# Altium project PROC101D_SCH_With_Design_Updates..Notes_V1.0.PrjPcb (part 16 of 23)

## Sheet 32.SchDoc
size 513 x 386 mm
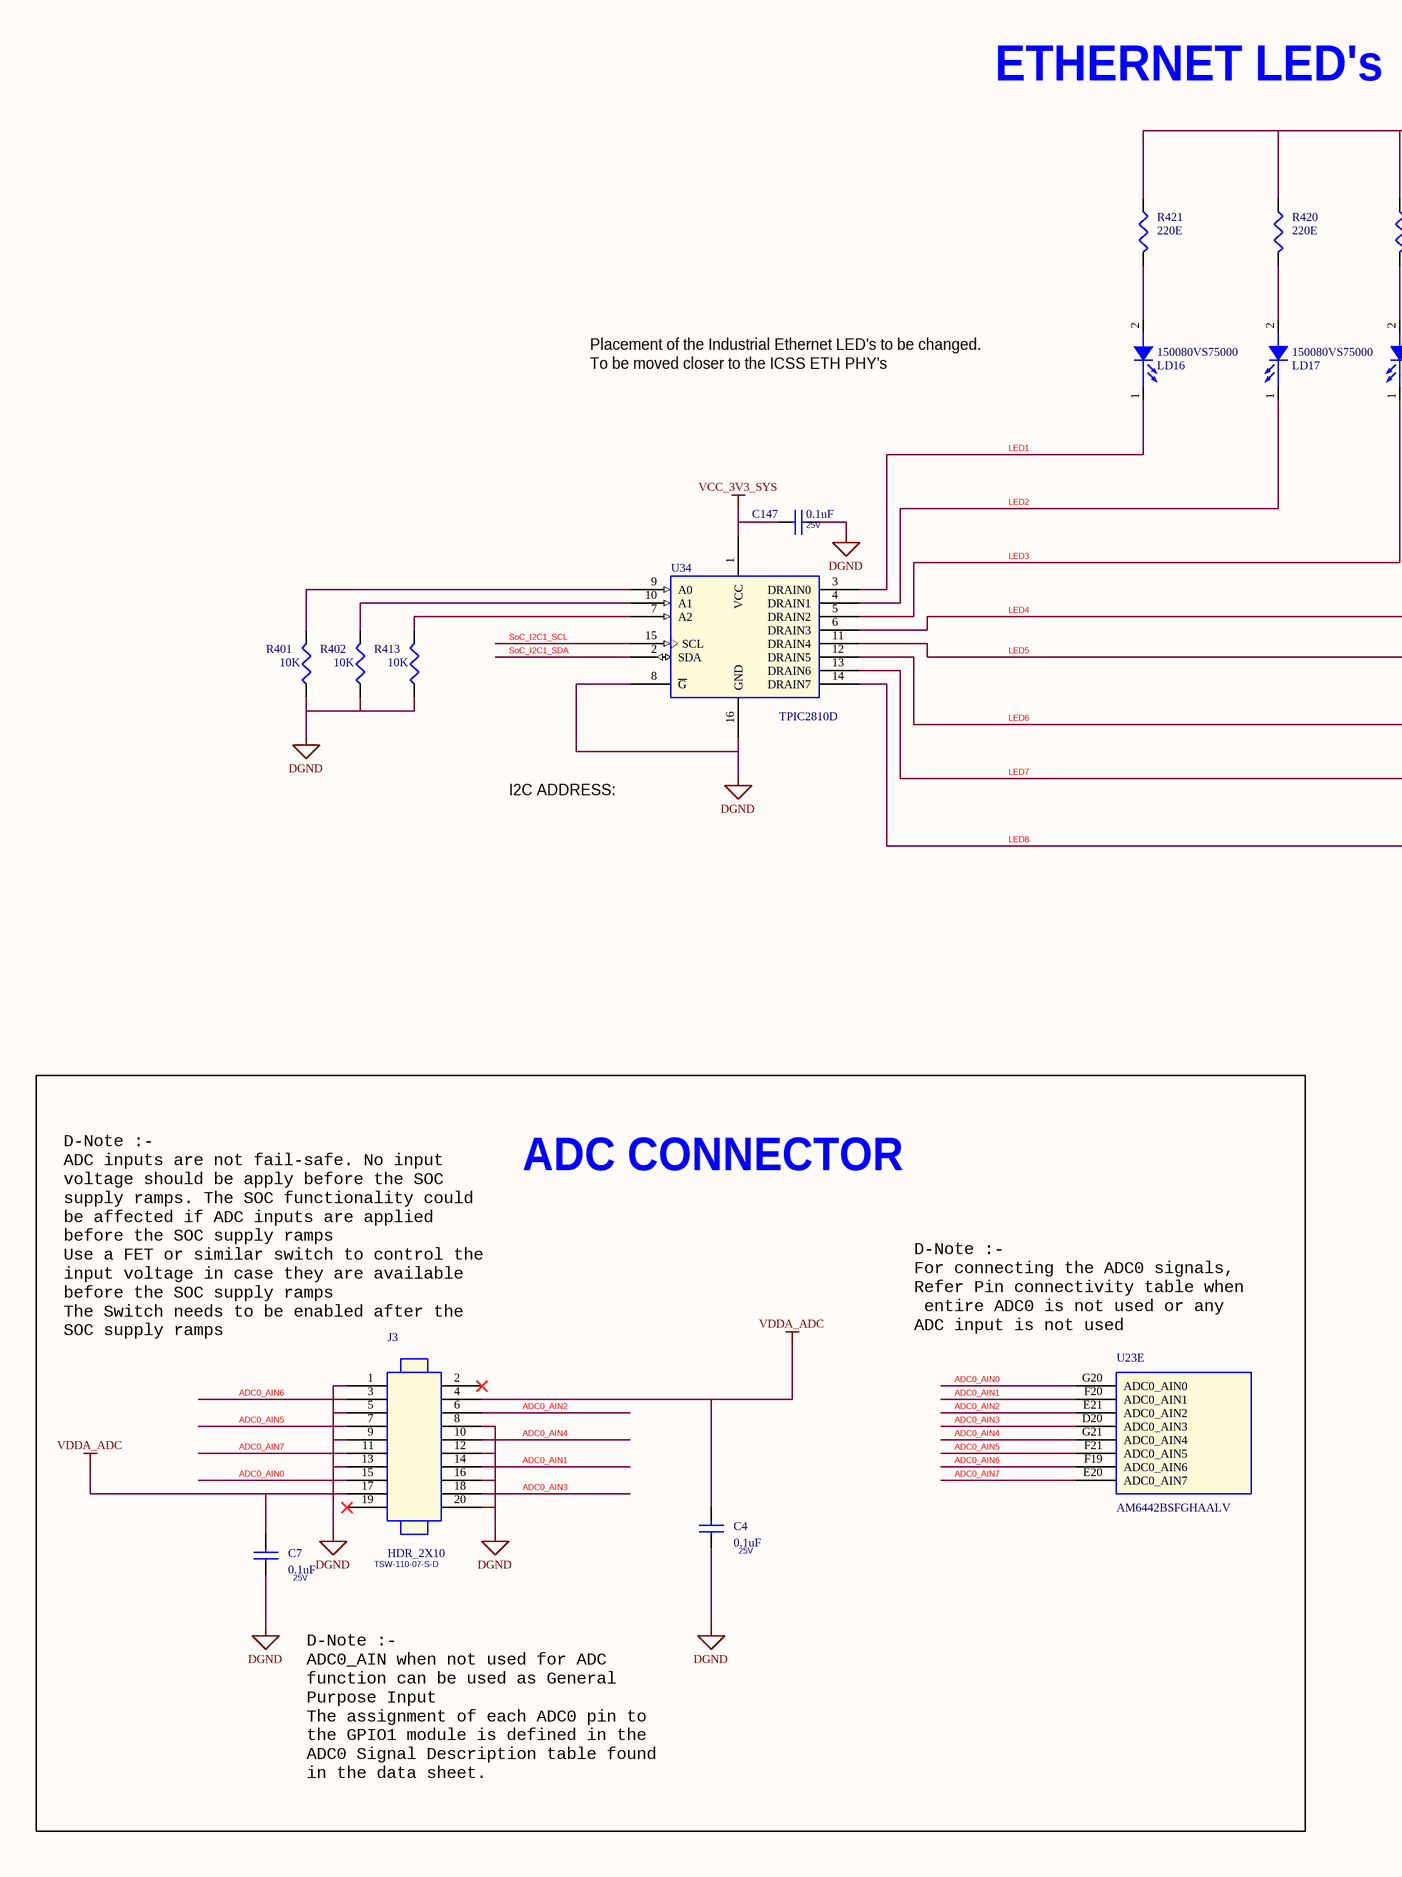
[diagram p58: 32.SchDoc, left]
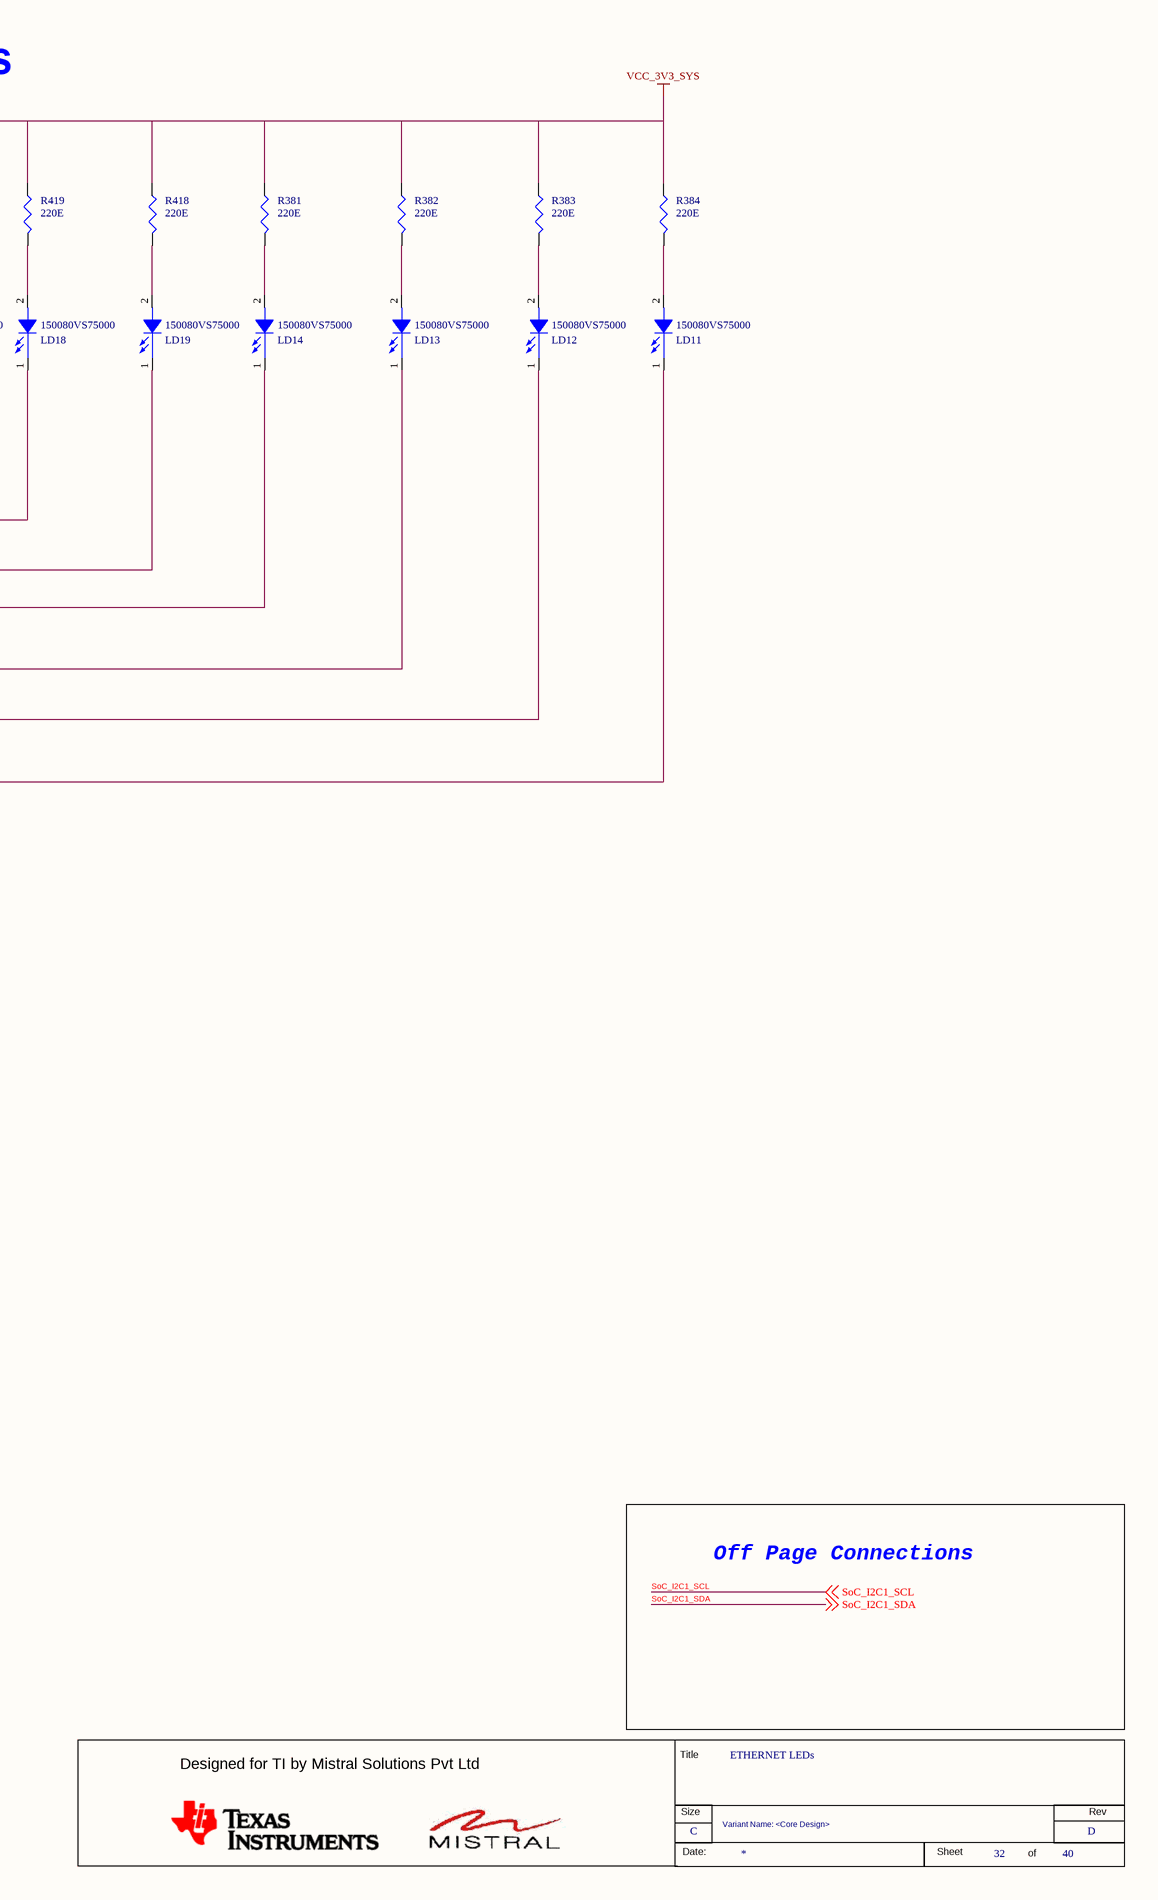
[diagram p59: 32.SchDoc, right]

### Parts
(Parts that share a designator on the sheet are numbered #1, #2 ... from top to bottom, then left to right.)
*#32  RevCode: D  Title: ETHERNET LEDs  Page Size: C  Page Number: 32  Page Count: 40  Variant Name: <Core Design>  (hidden comment: MISTRAL_TITLEBLK_CSIZE)  (graphical)
C4  0.1uF  Voltage: 25V  [CAP0402_0-75]
C7  0.1uF  Voltage: 25V  [CAP0402_0-75]
C147  0.1uF  Voltage: 25V  [CAP0402_0-75]
J3  HDR_2X10  Mfr_part_number: TSW-110-07-S-D  [HDR_2X10_TSW_100_S_T]
LD11  150080VS75000  [LED_150080VS75000_80X50_SMD_0-8]
LD12  150080VS75000  [LED_150080VS75000_80X50_SMD_0-8]
LD13  150080VS75000  [LED_150080VS75000_80X50_SMD_0-8]
LD14  150080VS75000  [LED_150080VS75000_80X50_SMD_0-8]
LD16  150080VS75000  [LED_150080VS75000_80X50_SMD_0-8]
LD17  150080VS75000  [LED_150080VS75000_80X50_SMD_0-8]
LD18  150080VS75000  [LED_150080VS75000_80X50_SMD_0-8]
LD19  150080VS75000  [LED_150080VS75000_80X50_SMD_0-8]
R381  220E  [RES0402_0-5]
R382  220E  [RES0402_0-5]
R383  220E  [RES0402_0-5]
R384  220E  [RES0402_0-5]
R401  10K  [RES0402_0-5]
R402  10K  [RES0402_0-5]
R413  10K  [RES0402_0-5]
R418  220E  [RES0402_0-5]
R419  220E  [RES0402_0-5]
R420  220E  [RES0402_0-5]
R421  220E  [RES0402_0-5]
U23  AM6442BSFGHAALV  [FCBGA441_31-49_680X680_2-6]  (part E of 16)
U34  TPIC2810D  [SOIC16_1-8]

### Blocks framed on the sheet
ADC CONNECTOR: C4 C7 J3 U23

### Nets
DGND: C4.1 C7.1 C147.2 J3.1 J3.5 J3.8 J3.9 J3.12 J3.13 J3.16 J3.20 R401.1 R402.1 R413.1 U34.8(~{G}) U34.16(GND)
VCC_3V3_SYS: C147.1 R381.1 R382.1 R383.1 R384.1 R418.1 R419.1 R420.1 R421.1 U34.1(VCC)
VDDA_ADC: C4.2 C7.2 J3.4 J3.17
ADC0_AIN0: J3.15 U23.G20(ADC0_AIN0)
ADC0_AIN1: J3.14 U23.F20(ADC0_AIN1)
ADC0_AIN2: J3.6 U23.E21(ADC0_AIN2)
ADC0_AIN3: J3.18 U23.D20(ADC0_AIN3)
ADC0_AIN4: J3.10 U23.G21(ADC0_AIN4)
ADC0_AIN5: J3.7 U23.F21(ADC0_AIN5)
ADC0_AIN6: J3.3 U23.F19(ADC0_AIN6)
ADC0_AIN7: J3.11 U23.E20(ADC0_AIN7)
LED1: LD16.1(CATHODE) U34.3(DRAIN0)
LED2: LD17.1(CATHODE) U34.4(DRAIN1)
LED3: LD18.1(CATHODE) U34.5(DRAIN2)
LED4: LD19.1(CATHODE) U34.6(DRAIN3)
LED5: LD14.1(CATHODE) U34.11(DRAIN4)
LED6: LD13.1(CATHODE) U34.12(DRAIN5)
LED7: LD12.1(CATHODE) U34.13(DRAIN6)
LED8: LD11.1(CATHODE) U34.14(DRAIN7)
SoC_I2C1_SCL: U34.15(SCL) ; off-sheet SoC_I2C1_SCL
SoC_I2C1_SDA: U34.2(SDA) ; off-sheet SoC_I2C1_SDA
NetLD11_2: LD11.2(ANODE) R384.2
NetLD12_2: LD12.2(ANODE) R383.2
NetLD13_2: LD13.2(ANODE) R382.2
NetLD14_2: LD14.2(ANODE) R381.2
NetLD16_2: LD16.2(ANODE) R421.2
NetLD17_2: LD17.2(ANODE) R420.2
NetLD18_2: LD18.2(ANODE) R419.2
NetLD19_2: LD19.2(ANODE) R418.2
NetR401_2: R401.2 U34.9(A0)
NetR402_2: R402.2 U34.10(A1)
NetR413_2: R413.2 U34.7(A2)

Not connected (* = marked no-connect by the designer): J3 2* 19*

### Notes on the sheet
- ETHERNET LED's
- Placement of the Industrial Ethernet LED's to be changed.
  To be moved closer to the ICSS ETH PHY's
- I2C ADDRESS: 0x60
- (near J3) D-Note :-
  ADC inputs are not fail-safe. No input
  voltage should be apply before the SOC
  supply ramps. The SOC functionality could
  be affected if ADC inputs are applied
  before the SOC supply ramps
  Use a FET or similar switch to control the
  input voltage in case they are available
  before the SOC supply ramps
  The Switch needs to be enabled after the
  SOC supply ramps
- D-Note :-
  For connecting the ADC0 signals,
  Refer Pin connectivity table when
  entire ADC0 is not used or any
  ADC input is not used
- D-Note :-
  ADC0_AIN when not used for ADC
  function can be used as General
  Purpose Input
  The assignment of each ADC0 pin to
  the GPIO1 module is defined in the
  ADC0 Signal Description table found
  in the data sheet.
- Off Page Connections
- (in symbol MISTRAL_TITLEBLK_CSIZE) Title; Designed for TI by Mistral Solutions Pvt Ltd; Size; Rev; Date:; Sheet; of

### Library data of the parts
*#32 = MISTRAL_TITLEBLK_CSIZE: Issue: 1.0; Page Create Date: March  8, 1995; Page Modify Date: *
C4 C7 = CAP_Dup3: as C34 on sheet 31; Footprint Path: Y:\MIS_DATABASE\Library\ALTIUM_TOOL\PCB_FOOTPRINTS\Altium_Footprint_Lib.PcbLib; Library Path: Y:\MIS_DATABASE\Library\ALTIUM_TOOL\SCHEMATICS_PARTS\MS_DISCRETE_Library.schlib; Footprint Ref: CAP0402_0-75; Library Ref: CAP; MECHANICAL 3D STEP FILE: CAP0402_0-75; Chkd/date: MANIRAJA/170820; Crtd /date: ALVY/170820; Datasheet: Y:\MIS_DATABASE\DATASHEETS\CAPACITORS\885012105018.PDF; Temperature: -55癈+85癈; Weight: 0.65mg; Height: 0.55MM; Distributor_part_number: 732-7495-1-ND; Distributor_name: DIGIKEY; Package: 0402; Tolerance: 20%; PCB Footprint: CAP0402_0-75
C147 = CAP_Dup3: as C252 on sheet 31; Tolerance: 20%; Package: 0402; Distributor_name: DIGIKEY; Distributor_part_number: 732-7495-1-ND; Height: 0.55MM; Weight: 0.65mg; Temperature: -55癈+85癈; Datasheet: Y:\MIS_DATABASE\DATASHEETS\CAPACITORS\885012105018.PDF; Crtd /date: ALVY/170820; Chkd/date: MANIRAJA/170820; MECHANICAL 3D STEP FILE: CAP0402_0-75; Library Ref: CAP; Footprint Ref: CAP0402_0-75; Library Path: Y:\MIS_DATABASE\Library\ALTIUM_TOOL\SCHEMATICS_PARTS\MS_DISCRETE_Library.schlib; Footprint Path: Y:\MIS_DATABASE\Library\ALTIUM_TOOL\PCB_FOOTPRINTS\Altium_Footprint_Lib.PcbLib; PCB Footprint: CAP0402_0-75
J3 = HEADER_10X2: CON HDR 2X10 2.54MM PITCH ST TH; Part_type: CONNECTOR\HEADERS; Mfr_name: SAMTEC; Mistral Part No: 150009090001-R; Custom_Duty: 0.24; Customs_HS_Code: 85369090; Wattage: NA; Project: SMART VIEW_NVR; PCB Footprint: HDR_2X10_TSW_100_S_T; Library Ref: HEADER_10X2; Chkd/date: NAVEED/140515; Crtd /date: MAZHAR/020909; Datasheet: Y:\MIS_DATABASE\DATASHEETS\CONNECTORS\TSW-106-23-T-S.PDF; Temperature: NA; Weight: NA; Height: 5.02MM; Distributor_part_number: SAM1032-10-ND; Distributor_name: DIGIKEY; Package: THRU-HOLE; Voltage: NA; Tolerance: NA
LD11-LD13 LD16 LD18 LD19 = DIODE_LED: DIODE LED BRIGHT GREEN SMD; Part_type: OPTO\LED; Mfr_name: WURTH ELECTRONICS; Mistral Part No: 130020080012-R; Custom_Duty: 24%; Customs_HS_Code: 85439000; Wattage: NA; Project: AM64x_EVM_BRD; Footprint Path: Y:\MIS_DATABASE\Library\ALTIUM_TOOL\PCB_FOOTPRINTS\Altium_Footprint_Lib.PcbLib; Library Path: Y:\MIS_DATABASE\Library\ALTIUM_TOOL\SCHEMATICS_PARTS\MS_OPTO_Library.schlib; MECHANICAL 3D STEP FILE: LED_150080VS75000_80X50_SMD_0-8; Chkd/date: MANIRAJA/180820; Crtd /date: ALVY/180820; Datasheet: Y:\MIS_DATABASE\DATASHEETS\DISCRETES\LEDS\150080VS75000.PDF; Temperature: -40癈+85癈; Weight: 10mg; Height: 0.80MM; Library Ref: DIODE_LED; Distributor_part_number: 732-4986-1-ND; Distributor_name: DIGIKEY; Package: SMD; Voltage: NA; Tolerance: NA; Mfr_part_number: 150080VS75000; Footprint Ref: LED_150080VS75000_80X50_SMD_0-8; PCB Footprint: LED_150080VS75000_80X50_SMD_0-8
LD14 LD17 = DIODE_LED: DIODE LED BRIGHT GREEN SMD; Mistral Part No: 130020080012-R; Mfr_name: WURTH ELECTRONICS; Part_type: OPTO\LED; Project: AM64x_EVM_BRD; Tolerance: NA; Customs_HS_Code: 85439000; Custom_Duty: 24%; Footprint Ref: LED_150080VS75000_80X50_SMD_0-8; Mfr_part_number: 150080VS75000; Voltage: NA; Wattage: NA; Package: SMD; Distributor_name: DIGIKEY; Distributor_part_number: 732-4986-1-ND; Library Ref: DIODE_LED; Height: 0.80MM; Weight: 10mg; Temperature: -40癈+85癈; Datasheet: Y:\MIS_DATABASE\DATASHEETS\DISCRETES\LEDS\150080VS75000.PDF; Crtd /date: ALVY/180820; Chkd/date: MANIRAJA/180820; MECHANICAL 3D STEP FILE: LED_150080VS75000_80X50_SMD_0-8; Library Path: Y:\MIS_DATABASE\Library\ALTIUM_TOOL\SCHEMATICS_PARTS\MS_OPTO_Library.schlib; Footprint Path: Y:\MIS_DATABASE\Library\ALTIUM_TOOL\PCB_FOOTPRINTS\Altium_Footprint_Lib.PcbLib; PCB Footprint: LED_150080VS75000_80X50_SMD_0-8
R381 R420 R421 = RESISTOR_Dup6: RES 220E 1/10W 5% 0402; Part_type: RESISTORS\FIXED; Mfr_part_number: ERJ-2GEJ221X; Mfr_name: PANASONIC-ECG; Mistral Part No: 110009030506-R; Custom_Duty: 15%; Customs_HS_Code: 85332119; Project: RED EYE; Voltage: NA; Footprint Ref: RES0402_0-5; Chkd/date: VASANTHA/291216; Crtd /date: GEETHA/260406; Datasheet: Y:\MIS_DATABASE\DATASHEETS\RESISTORS\PAN-ERJSER_NOV17.PDF; Height: 0.40MM; Distributor_part_number: P220JCT-ND; Distributor_name: DIGIKEY; Package: 0402; Wattage: 1/10W; Tolerance: 5%; Library Ref: RESISTOR; Weight: 0.8mg; Temperature: -55癈+155癈; MECHANICAL 3D STEP FILE: RES0402_0-5; Library Path: Y:\MIS_DATABASE\Library\ALTIUM_TOOL\SCHEMATICS_PARTS\MS_DISCRETE_Library.schlib; Footprint Path: Y:\MIS_DATABASE\Library\ALTIUM_TOOL\PCB_FOOTPRINTS\Altium_Footprint_Lib.PcbLib; PCB Footprint: RES0402_0-5
R382-R384 = RESISTOR_Dup6: RES 220E 1/10W 5% 0402; Part_type: RESISTORS\FIXED; Mfr_part_number: ERJ-2GEJ221X; Mfr_name: PANASONIC-ECG; Mistral Part No: 110009030506-R; Voltage: NA; Custom_Duty: 15%; Customs_HS_Code: 85332119; Project: RED EYE; Footprint Path: Y:\MIS_DATABASE\Library\ALTIUM_TOOL\PCB_FOOTPRINTS\Altium_Footprint_Lib.PcbLib; Library Path: Y:\MIS_DATABASE\Library\ALTIUM_TOOL\SCHEMATICS_PARTS\MS_DISCRETE_Library.schlib; MECHANICAL 3D STEP FILE: RES0402_0-5; Temperature: -55癈+155癈; Weight: 0.8mg; Library Ref: RESISTOR; Chkd/date: VASANTHA/291216; Crtd /date: GEETHA/260406; Datasheet: Y:\MIS_DATABASE\DATASHEETS\RESISTORS\PAN-ERJSER_NOV17.PDF; Height: 0.40MM; Distributor_part_number: P220JCT-ND; Distributor_name: DIGIKEY; Package: 0402; Wattage: 1/10W; Tolerance: 5%; Footprint Ref: RES0402_0-5; PCB Footprint: RES0402_0-5
R401 = RESISTOR_Dup6: as R248 on sheet 31; Tolerance: 5%; Wattage: 1/16W; Package: 0402; Distributor_name: DIGIKEY; Distributor_part_number: 311-10KJRCT-ND; Height: 0.40MM; Weight: 0.65mg; Temperature: -55癈+155癈; Datasheet: Y:\MIS_DATABASE\DATASHEETS\RESISTORS\RCXXXXL-SER_MAR18.PDF; Crtd /date: MAZHAR/230805; Chkd/date: VASANTHA/061216; MECHANICAL 3D STEP FILE: RES0402_0-5; Library Ref: RESISTOR; Footprint Ref: RES0402_0-5; Library Path: Y:\MIS_DATABASE\Library\ALTIUM_TOOL\SCHEMATICS_PARTS\MS_DISCRETE_Library.schlib; Footprint Path: Y:\MIS_DATABASE\Library\ALTIUM_TOOL\PCB_FOOTPRINTS\Altium_Footprint_Lib.PcbLib; PCB Footprint: RES0402_0-5
R402 R413 = RESISTOR_Dup6: as R40 on sheet 31; MECHANICAL 3D STEP FILE: RES0402_0-5; Chkd/date: VASANTHA/061216; Crtd /date: MAZHAR/230805; Datasheet: Y:\MIS_DATABASE\DATASHEETS\RESISTORS\RCXXXXL-SER_MAR18.PDF; Temperature: -55癈+155癈; Weight: 0.65mg; Height: 0.40MM; Distributor_part_number: 311-10KJRCT-ND; Distributor_name: DIGIKEY; Package: 0402; Wattage: 1/16W; Tolerance: 5%; Library Ref: RESISTOR; Footprint Ref: RES0402_0-5; Library Path: Y:\MIS_DATABASE\Library\ALTIUM_TOOL\SCHEMATICS_PARTS\MS_DISCRETE_Library.schlib; Footprint Path: Y:\MIS_DATABASE\Library\ALTIUM_TOOL\PCB_FOOTPRINTS\Altium_Footprint_Lib.PcbLib; PCB Footprint: RES0402_0-5
R418 R419 = RESISTOR_Dup6: RES 220E 1/10W 5% 0402; Mistral Part No: 110009030506-R; Mfr_name: PANASONIC-ECG; Mfr_part_number: ERJ-2GEJ221X; Part_type: RESISTORS\FIXED; Project: RED EYE; Customs_HS_Code: 85332119; Custom_Duty: 15%; Voltage: NA; Footprint Ref: RES0402_0-5; Tolerance: 5%; Wattage: 1/10W; Package: 0402; Distributor_name: DIGIKEY; Distributor_part_number: P220JCT-ND; Height: 0.40MM; Datasheet: Y:\MIS_DATABASE\DATASHEETS\RESISTORS\PAN-ERJSER_NOV17.PDF; Crtd /date: GEETHA/260406; Chkd/date: VASANTHA/291216; Library Ref: RESISTOR; Weight: 0.8mg; Temperature: -55癈+155癈; MECHANICAL 3D STEP FILE: RES0402_0-5; Library Path: Y:\MIS_DATABASE\Library\ALTIUM_TOOL\SCHEMATICS_PARTS\MS_DISCRETE_Library.schlib; Footprint Path: Y:\MIS_DATABASE\Library\ALTIUM_TOOL\PCB_FOOTPRINTS\Altium_Footprint_Lib.PcbLib; PCB Footprint: RES0402_0-5
U23 = XAM6442BSFGGAALV_BGA441: IC AM64x SoC MICROPROCESSOR BGA441; Mistral Part No: 141220080002; Mfr_name: TEXAS INSTRUMENTS; Part_type: ICS\DIGITAL\MICROPROCESSOR; Project: AM64x-GP_EVM BRD; Tolerance: NA; Customs_HS_Code: 85423100; Custom_Duty: 15%; PCB Footprint: FCBGA441_31-49_680X680_2-6; Footprint Ref: FCBGA441_31-49_680X680_2-6; Mfr_part_number: AM6442BSFGHAALV; Voltage: NA; Wattage: NA; Package: BGA441; Distributor_name: NA; Distributor_part_number: NA; Library Ref: XAM6442BSFGGAALV_BGA441; Height: 2.57MM; Weight: NA; Temperature: NA; Datasheet: Y:\MIS_DATABASE\DATASHEETS\ICS\DIGITAL\MICROCONTROLLER\AM64-SoC_SVB.PDF; Crtd /date: ALVY/300322; Chkd/date: ALVY/300322; RoHS: NA; MECHANICAL 3D STEP FILE: FCBGA441_31-49_680X680_2-6; Library Path: Y:\MIS_DATABASE\Library\ALTIUM_TOOL\SCHEMATICS_PARTS\MS_MICROPROCESSOR_Library.schlib; Footprint Path: Y:\MIS_DATABASE\Library\ALTIUM_TOOL\PCB_FOOTPRINTS\Altium_Footprint_Lib.PcbLib
U34 = TPIC2810D_SOIC16: IC 8-BIT LED DRIVER WITH I2C INTERFACE SOIC16; Mistral Part No: 141017080026-R; Mfr_name: TEXAS INSTRUMENTS; Part_type: ICS\INTERFACE; Project: TI_MAXIE_CPB; Tolerance: NA; Customs_HS_Code: 85423100; Custom_Duty: 15%; Mfr_part_number: TPIC2810D; Voltage: NA; Wattage: NA; Package: SOIC16; Distributor_name: DIGIKEY; Distributor_part_number: 296-13746-5-ND; Height: 1.75MM; Weight: NA; Temperature: -40癈+125癈; Datasheet: Y:\MIS_DATABASE\DATASHEETS\ICS\INTERFACE\TPIC2810D.PDF; Crtd /date: MANIRAJA/220817; Chkd/date: MANIRAJA/230817; MECHANICAL 3D STEP FILE: SOIC16_1-8; Library Ref: TPIC2810D_SOIC16; PCB Footprint: SOIC16_1-8

## Sheet 33.SchDoc
size 513 x 386 mm
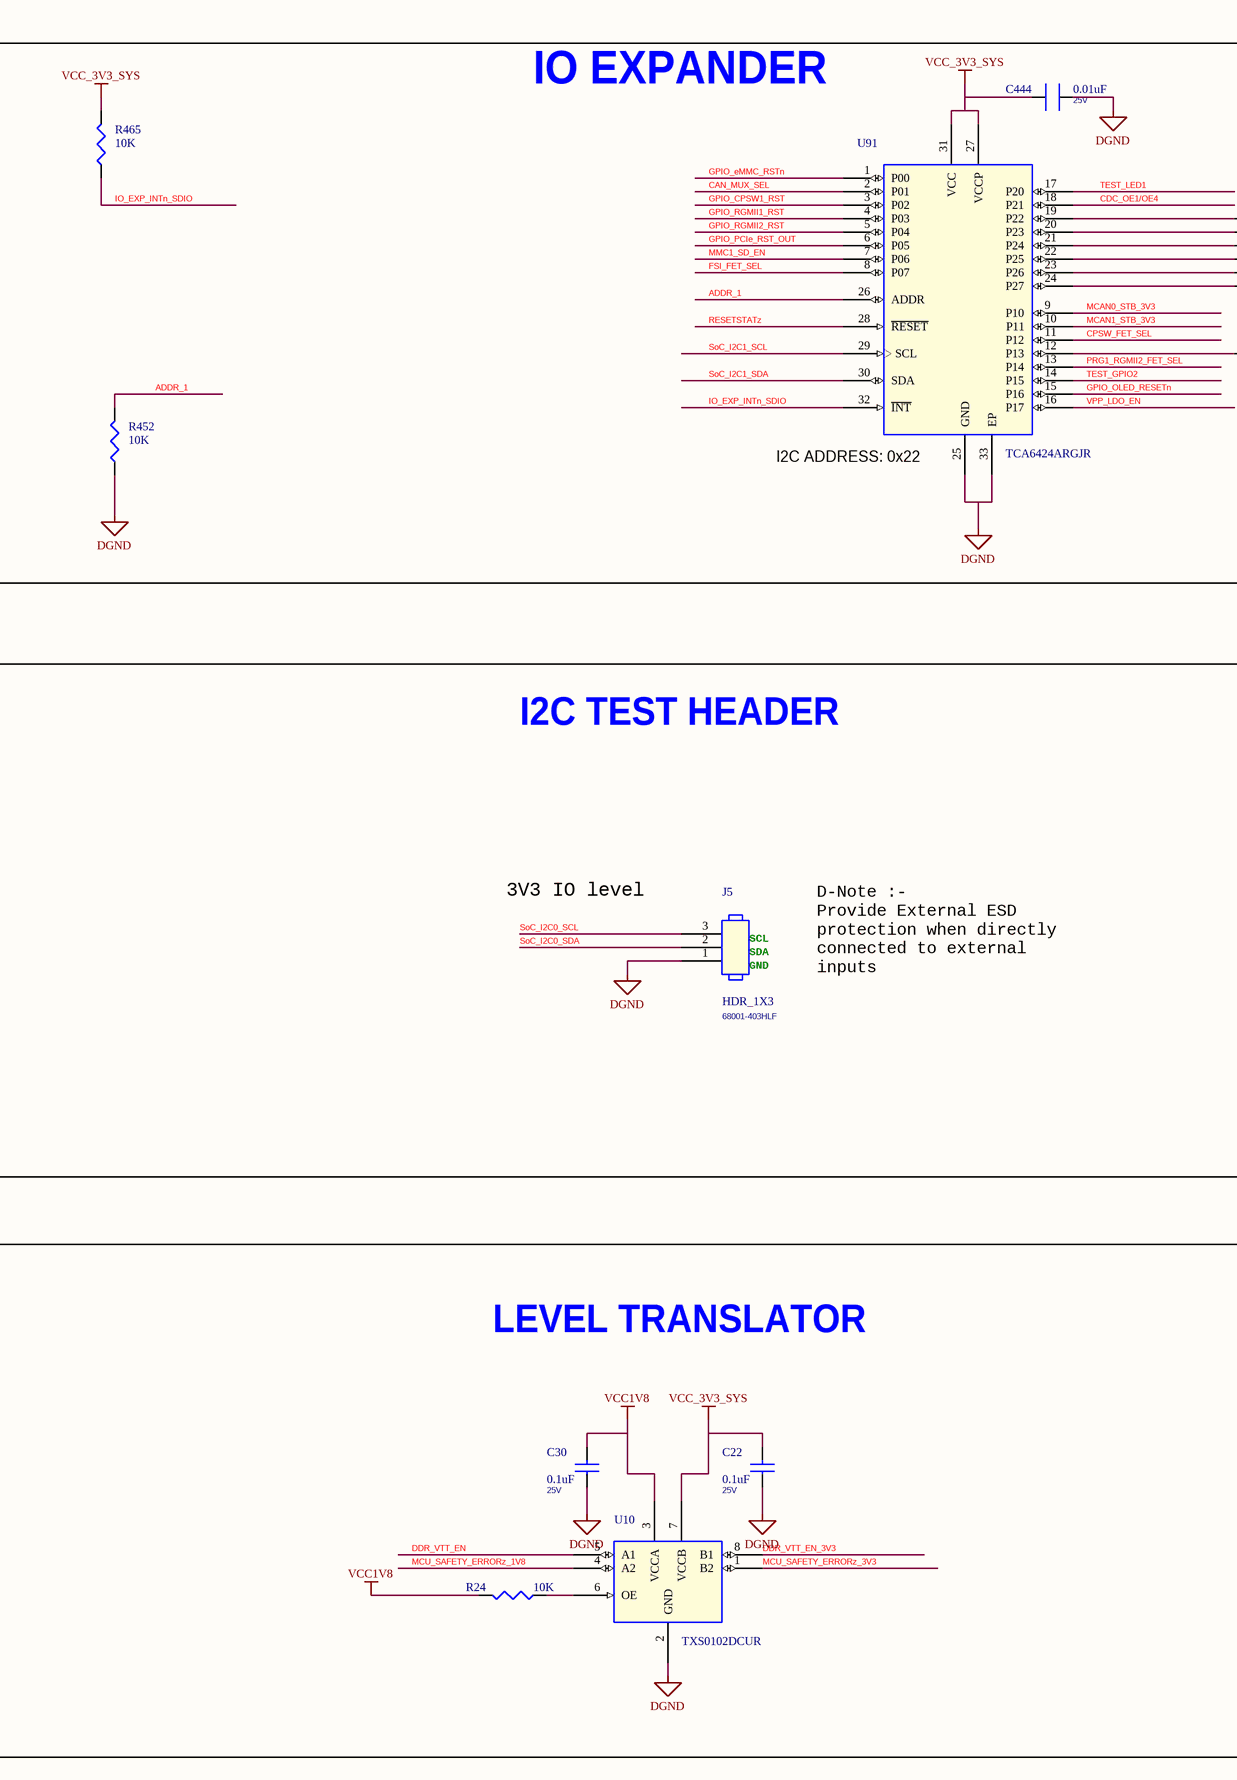
[diagram p60: 33.SchDoc, left]
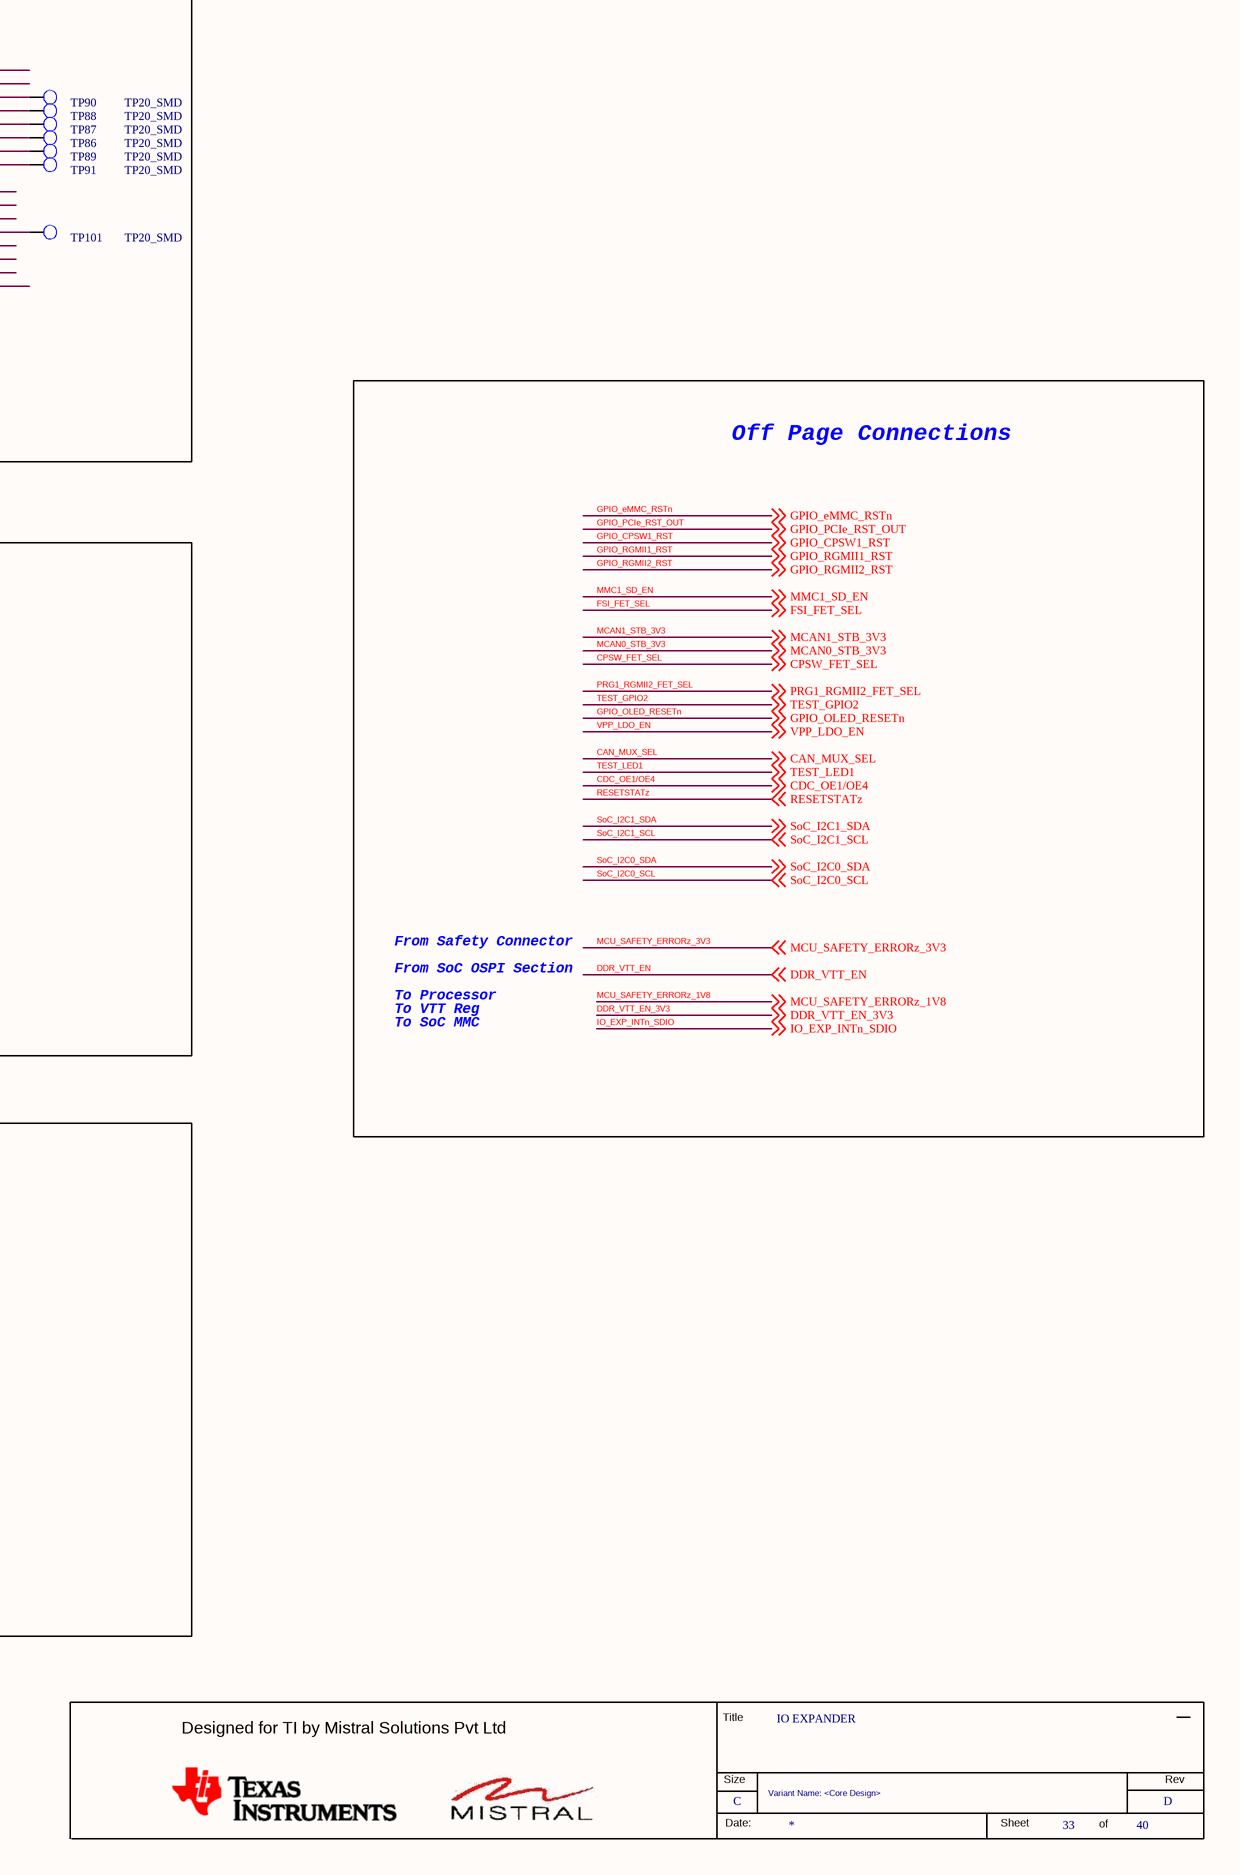
[diagram p61: 33.SchDoc, right]

### Parts
(Parts that share a designator on the sheet are numbered #1, #2 ... from top to bottom, then left to right.)
*#33  RevCode: D  Title: IO EXPANDER  Page Size: C  Page Number: 33  Page Count: 40  Variant Name: <Core Design>  (hidden comment: MISTRAL_TITLEBLK_CSIZE)  (graphical)
C22  0.1uF  Voltage: 25V  [CAP0402_0-75]
C30  0.1uF  Voltage: 25V  [CAP0402_0-75]
C444  0.01uF  Voltage: 25V  [CAP0402N]
J5  HDR_1X3  Mfr_part_number: 68001-403HLF  [HDR_3X1_100_S_T]
R24  10K  [RES0402_0-5]
R452  10K  [RES0402_0-5]
R465  10K  [RES0402_0-5]
TP86  TP20_SMD  [TP20_SMD]
TP87  TP20_SMD  [TP20_SMD]
TP88  TP20_SMD  [TP20_SMD]
TP89  TP20_SMD  [TP20_SMD]
TP90  TP20_SMD  [TP20_SMD]
TP91  TP20_SMD  [TP20_SMD]
TP101  TP20_SMD  [TP20_SMD]
U10  TXS0102DCUR  [VSSOP8_19-68_85X95_0-9]
U91  TCA6424ARGJR  [QFN32_19-68_200X200]

### Blocks framed on the sheet
IO EXPANDER: C444 R452 R465 TP86-TP91 TP101 U91
I2C TEST HEADER: J5
LEVEL TRANSLATOR: C22 C30 R24 U10

### Nets
DGND: C22.1 C30.1 C444.1 J5.1 R452.1 U10.2(GND) U91.25(GND) U91.33(EP)
VCC1V8: C30.2 R24.2 U10.3(VCCA)
VCC_3V3_SYS: C22.2 C444.2 R465.2 U10.7(VCCB) U91.27(VCCP) U91.31(VCC)
ADDR_1: R452.2 U91.26(ADDR)
CAN_MUX_SEL: U91.2(P01) ; off-sheet CAN_MUX_SEL
CDC_OE1/OE4: U91.18(P21) ; off-sheet CDC_OE1/OE4
CPSW_FET_SEL: U91.11(P12) ; off-sheet CPSW_FET_SEL
DDR_VTT_EN: U10.5(A1) ; off-sheet DDR_VTT_EN
DDR_VTT_EN_3V3: U10.8(B1) ; off-sheet DDR_VTT_EN_3V3
FSI_FET_SEL: U91.8(P07) ; off-sheet FSI_FET_SEL
GPIO_CPSW1_RST: U91.3(P02) ; off-sheet GPIO_CPSW1_RST
GPIO_eMMC_RSTn: U91.1(P00) ; off-sheet GPIO_eMMC_RSTn
GPIO_OLED_RESETn: U91.15(P16) ; off-sheet GPIO_OLED_RESETn
GPIO_PCIe_RST_OUT: U91.6(P05) ; off-sheet GPIO_PCIe_RST_OUT
GPIO_RGMII1_RST: U91.4(P03) ; off-sheet GPIO_RGMII1_RST
GPIO_RGMII2_RST: U91.5(P04) ; off-sheet GPIO_RGMII2_RST
IO_EXP_INTn_SDIO: R465.1 U91.32(~{INT}) ; off-sheet IO_EXP_INTn_SDIO
MCAN0_STB_3V3: U91.9(P10) ; off-sheet MCAN0_STB_3V3
MCAN1_STB_3V3: U91.10(P11) ; off-sheet MCAN1_STB_3V3
MCU_SAFETY_ERRORz_1V8: U10.4(A2) ; off-sheet MCU_SAFETY_ERRORz_1V8
MCU_SAFETY_ERRORz_3V3: U10.1(B2) ; off-sheet MCU_SAFETY_ERRORz_3V3
MMC1_SD_EN: U91.7(P06) ; off-sheet MMC1_SD_EN
PRG1_RGMII2_FET_SEL: U91.13(P14) ; off-sheet PRG1_RGMII2_FET_SEL
RESETSTATz: U91.28(~{RESET}) ; off-sheet RESETSTATz
SoC_I2C0_SCL: J5.3 ; off-sheet SoC_I2C0_SCL
SoC_I2C0_SDA: J5.2 ; off-sheet SoC_I2C0_SDA
SoC_I2C1_SCL: U91.29(SCL) ; off-sheet SoC_I2C1_SCL
SoC_I2C1_SDA: U91.30(SDA) ; off-sheet SoC_I2C1_SDA
TEST_GPIO2: U91.14(P15) ; off-sheet TEST_GPIO2
TEST_LED1: U91.17(P20) ; off-sheet TEST_LED1
VPP_LDO_EN: U91.16(P17) ; off-sheet VPP_LDO_EN
NetR24_1: R24.1 U10.6(OE)
NetTP86_1: TP86.1(TP) U91.22(P25)
NetTP87_1: TP87.1(TP) U91.21(P24)
NetTP88_1: TP88.1(TP) U91.20(P23)
NetTP89_1: TP89.1(TP) U91.23(P26)
NetTP90_1: TP90.1(TP) U91.19(P22)
NetTP91_1: TP91.1(TP) U91.24(P27)
NetTP101_1: TP101.1(TP) U91.12(P13)

### Notes on the sheet
- (near U91) I2C ADDRESS: 0x22
- Off Page Connections
- 3V3 IO level
- D-Note :-
  Provide External ESD
  protection when directly
  connected to external
  inputs
- (near J5) SCL
- (near J5) SDA
- (near J5) GND
- To Processor
- From Safety Connector
- From SoC OSPI Section
- To VTT Reg
- To SoC MMC
- (in symbol MISTRAL_TITLEBLK_CSIZE) Title; Designed for TI by Mistral Solutions Pvt Ltd; Size; Rev; Date:; Sheet; of

### Library data of the parts
*#33 = MISTRAL_TITLEBLK_CSIZE: Issue: 1.0; Page Create Date: March  8, 1995; Page Modify Date: *
C22 C30 = CAP_Dup3: as C34 on sheet 31; PCB Footprint: CAP0402_0-75; Footprint Path: Y:\MIS_DATABASE\Library\ALTIUM_TOOL\PCB_FOOTPRINTS\Altium_Footprint_Lib.PcbLib; Library Path: Y:\MIS_DATABASE\Library\ALTIUM_TOOL\SCHEMATICS_PARTS\MS_DISCRETE_Library.schlib; Footprint Ref: CAP0402_0-75; Library Ref: CAP; MECHANICAL 3D STEP FILE: CAP0402_0-75; Chkd/date: MANIRAJA/170820; Crtd /date: ALVY/170820; Datasheet: Y:\MIS_DATABASE\DATASHEETS\CAPACITORS\885012105018.PDF; Temperature: -55癈+85癈; Weight: 0.65mg; Height: 0.55MM; Distributor_part_number: 732-7495-1-ND; Distributor_name: DIGIKEY; Package: 0402; Tolerance: 20%
C444 = CAP_Dup2: CAP CERAMIC 0.01uF 25V 10% X7R 0402; Part_type: CAPACITORS\CERAMIC; Mfr_part_number: 885012205050; Mfr_name: WURTH ELECTRONICS; Mistral Part No: 120011090040-R; PCB Footprint: CAP0402_0-75; Wattage: NA; Custom_Duty: 15%; Customs_HS_Code: 85322990; Project: AM64x_EVM_BRD; Footprint Path: Y:\MIS_DATABASE\Library\ALTIUM_TOOL\PCB_FOOTPRINTS\Altium_Footprint_Lib.PcbLib; Library Path: Y:\MIS_DATABASE\Library\ALTIUM_TOOL\SCHEMATICS_PARTS\MS_DISCRETE_Library.schlib; Footprint Ref: CAP0402_0-75; MECHANICAL 3D STEP FILE: CAP0402_0-75; Temperature: -55癈+125癈; Weight: 0.65mg; Chkd/date: MANIRAJA/170820; Crtd /date: ALVY/170820; Datasheet: Y:\MIS_DATABASE\DATASHEETS\CAPACITORS\885012205050.PDF; Height: 0.55MM; Distributor_part_number: 732-7545-1-ND; Distributor_name: DIGIKEY; Package: 0402; Tolerance: 10%; Library Ref: CAP
J5 = HEADER_3X1: HDR 1X3 2.54MM PITCH ST TH; Mistral Part No: 150016060025-R; Mfr_name: FCI; Part_type: CONNECTOR\HEADERS; Project: IKEYP; Tolerance: NA; Customs_HS_Code: 85322990; Custom_Duty: 15%; Voltage: NA; Wattage: NA; Package: THRU-HOLE; Distributor_name: DIGIKEY; Distributor_part_number: 609-3471-ND; Height: 8.58MM; Weight: NA; Temperature: -40癈+105癈; Datasheet: Y:\MIS_DATABASE\DATASHEETS\CONNECTORS\68000.PDF; Crtd /date: VASANTHA/290616; Chkd/date: VASANTHA/290616; Library Ref: HEADER_3X1; PCB Footprint: HDR_3X1_100_S_T
R24 R452 = RESISTOR_Dup6: as R40 on sheet 31; Footprint Path: Y:\MIS_DATABASE\Library\ALTIUM_TOOL\PCB_FOOTPRINTS\Altium_Footprint_Lib.PcbLib; Library Path: Y:\MIS_DATABASE\Library\ALTIUM_TOOL\SCHEMATICS_PARTS\MS_DISCRETE_Library.schlib; Footprint Ref: RES0402_0-5; Library Ref: RESISTOR; MECHANICAL 3D STEP FILE: RES0402_0-5; Chkd/date: VASANTHA/061216; Crtd /date: MAZHAR/230805; Datasheet: Y:\MIS_DATABASE\DATASHEETS\RESISTORS\RCXXXXL-SER_MAR18.PDF; Temperature: -55癈+155癈; Weight: 0.65mg; Height: 0.40MM; Distributor_part_number: 311-10KJRCT-ND; Distributor_name: DIGIKEY; Package: 0402; Wattage: 1/16W; Tolerance: 5%; PCB Footprint: RES0402_0-5
R465 = RESISTOR_Dup6: as R248 on sheet 31; PCB Footprint: RES0402_0-5; Footprint Path: Y:\MIS_DATABASE\Library\ALTIUM_TOOL\PCB_FOOTPRINTS\Altium_Footprint_Lib.PcbLib; Library Path: Y:\MIS_DATABASE\Library\ALTIUM_TOOL\SCHEMATICS_PARTS\MS_DISCRETE_Library.schlib; Footprint Ref: RES0402_0-5; Library Ref: RESISTOR; Tolerance: 5%; Wattage: 1/16W; Package: 0402; Distributor_name: DIGIKEY; Distributor_part_number: 311-10KJRCT-ND; Height: 0.40MM; Weight: 0.65mg; Temperature: -55癈+155癈; Datasheet: Y:\MIS_DATABASE\DATASHEETS\RESISTORS\RCXXXXL-SER_MAR18.PDF; Crtd /date: MAZHAR/230805; Chkd/date: VASANTHA/061216; MECHANICAL 3D STEP FILE: RES0402_0-5
TP86-TP91 = TESTPOINT: TESTPOINT CIR 20 SMD; Mfr_name: LOCAL; Custom_Duty: NA; Project: BT MODULE_CSRBC04; Customs_HS_Code: NA; PCB Footprint: TP20_SMD; RoHS: NA; Footprint Ref: TP20_SMD; Library Ref: TESTPOINT; Footprint Path: Y:\MIS_DATABASE\Library\ALTIUM_TOOL\PCB_FOOTPRINTS\Altium_Footprint_Lib.PcbLib; Library Path: Y:\MIS_DATABASE\Library\ALTIUM_TOOL\SCHEMATICS_PARTS\MS_DISCRETE_Library.schlib; MECHANICAL 3D STEP FILE: NA; Datasheet: NA; Temperature: NA; Weight: NA; Wattage: NA; Voltage: NA; Tolerance: NA; Chkd/date: SHREESHAIL/171006; Crtd /date: MAZHAR/171006; Height: NA; Distributor_part_number: NA; Distributor_name: NA; Package: SMD; Part_type: TESTPOINT; Mfr_part_number: TP20_SMD; Mistral Part No: NA
TP101 = TESTPOINT: TESTPOINT CIR 20 SMD; Mistral Part No: NA; Mfr_name: LOCAL; Project: BT MODULE_CSRBC04; Mfr_part_number: TP20_SMD; Part_type: TESTPOINT; Package: SMD; Distributor_name: NA; Distributor_part_number: NA; Height: NA; Crtd /date: MAZHAR/171006; Chkd/date: SHREESHAIL/171006; Tolerance: NA; Voltage: NA; Wattage: NA; Weight: NA; Temperature: NA; Datasheet: NA; MECHANICAL 3D STEP FILE: NA; Library Path: Y:\MIS_DATABASE\Library\ALTIUM_TOOL\SCHEMATICS_PARTS\MS_DISCRETE_Library.schlib; Footprint Path: Y:\MIS_DATABASE\Library\ALTIUM_TOOL\PCB_FOOTPRINTS\Altium_Footprint_Lib.PcbLib; Library Ref: TESTPOINT; Footprint Ref: TP20_SMD; RoHS: NA; Customs_HS_Code: NA; Custom_Duty: NA; PCB Footprint: TP20_SMD
U10 = TXS0102DCUR_VSSOP8: IC 2BIT BI-DIR VOLTAGE-LEVEL TRANSLATOR US8(VSSOP8); Mistral Part No: 141009030376-R; Mfr_name: TEXAS INSTRUMENTS; Part_type: ICS\INTERFACE\LEVEL TRANSLATOR; Project: SD_WATERLOO; Tolerance: NA; Customs_HS_Code: 85423100; Custom_Duty: 15%; PCB Footprint: VSSOP8_19-68_85X95_0-9; Footprint Ref: VSSOP8_19-68_85X95_0-9; Library Ref: TXS0102DCUR_VSSOP8; Mfr_part_number: TXS0102DCUR; Voltage: NA; Wattage: NA; Package: US8; Distributor_name: DIGIKEY; Distributor_part_number: 296-21931-1-ND; Height: 0.90MM; Weight: 9.6mg; Temperature: -40癈+85癈; Datasheet: Y:\MIS_DATABASE\DATASHEETS\ICS\INTERFACE\TXS0102.PDF; Crtd /date: SHREESHAIL/190108; Chkd/date: MANIRAJA/130617; MECHANICAL 3D STEP FILE: VSSOP8_19-68_85X95_0-9; Library Path: Y:\MIS_DATABASE\Library\ALTIUM_TOOL\SCHEMATICS_PARTS\MS_MISCINTERFACE_Library.schlib; Footprint Path: Y:\MIS_DATABASE\Library\ALTIUM_TOOL\PCB_FOOTPRINTS\Altium_Footprint_Lib.PcbLib
U91 = TCA6424ARGJR_QFN32: IC I2C I/O EXPANDER 24B UQFN32; Part_type: ICS\DIGITAL\BUSTRANSCEIVER; Mfr_name: TEXAS INSTRUMENTS; Mistral Part No: 141014090009-R; Custom_Duty: 15%; Customs_HS_Code: 85423100; Project: ZK_BIOMETRIC; PCB Footprint: QFN32_19-68_200X200; Library Ref: TCA6424ARGJR_QFN32; Chkd/date: NAVEED/100715; Crtd /date: NAVEED/100914; Datasheet: Y:\MIS_DATABASE\DATASHEETS\ICS\DIGITAL\BUSTRANSCEIVER\TCA6424AR.PDF; Temperature: -40癈+85癈; Weight: NA; Height: 0.60MM; Distributor_part_number: 296-27844-1-ND; Distributor_name: DIGIKEY; Package: UQFN32; Mfr_part_number: TCA6424ARGJR

## Sheet 34.SchDoc
size 513 x 386 mm
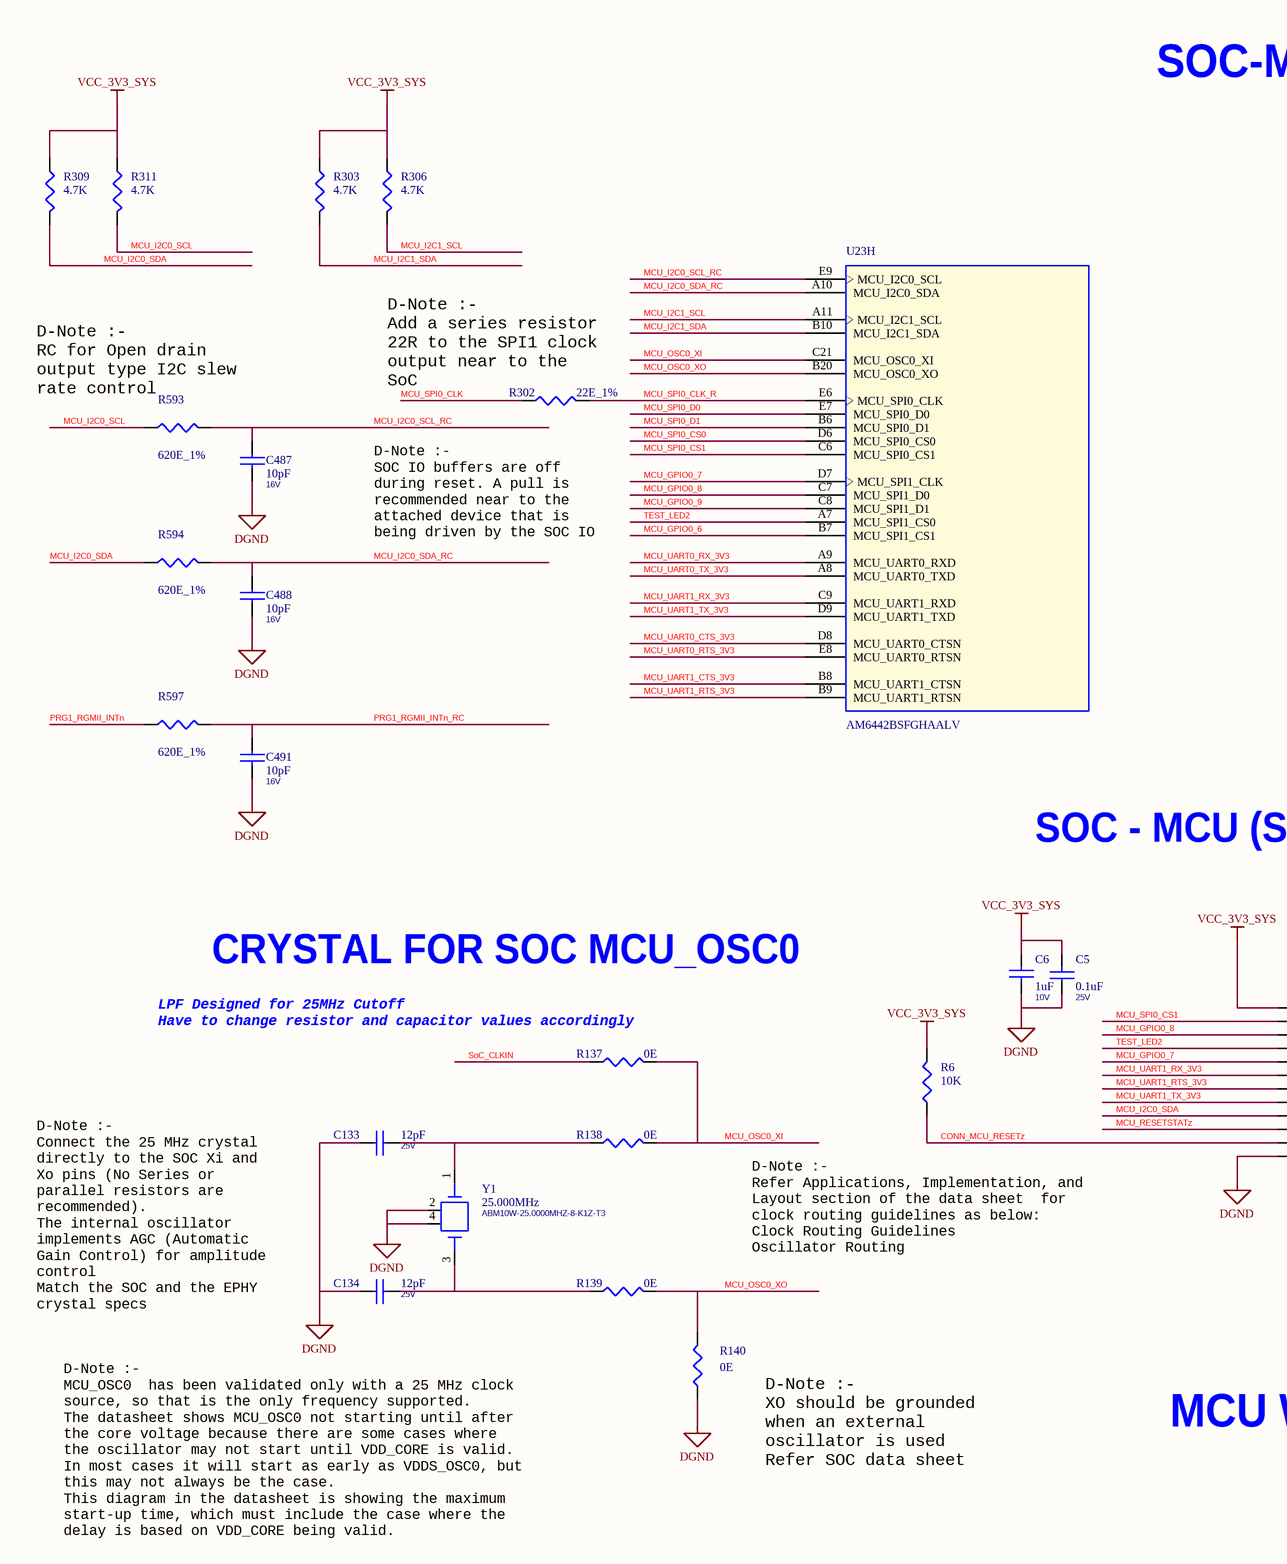
[diagram p62: 34.SchDoc, top left]
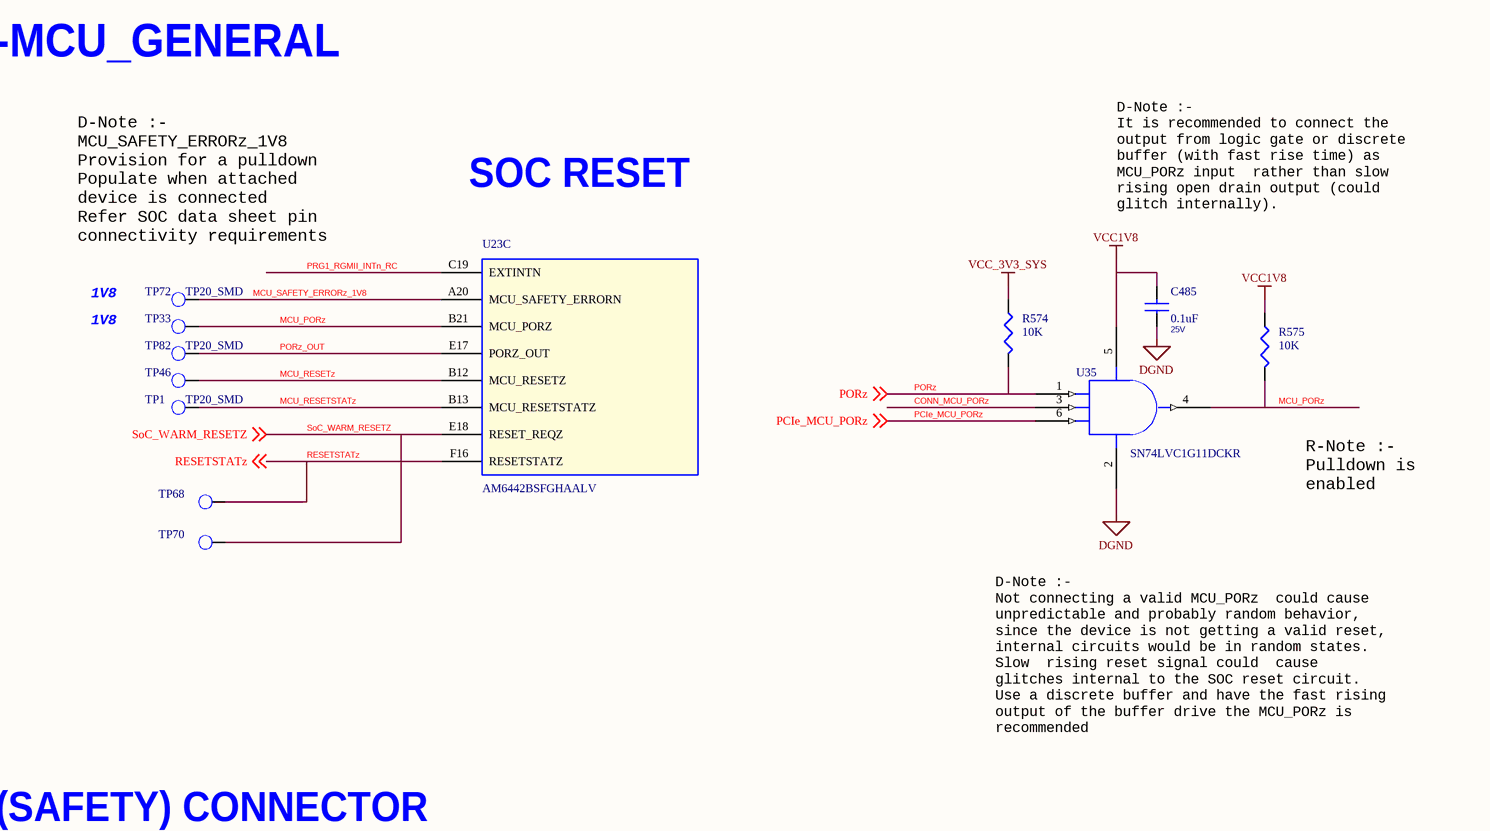
[diagram p63: 34.SchDoc, top right]
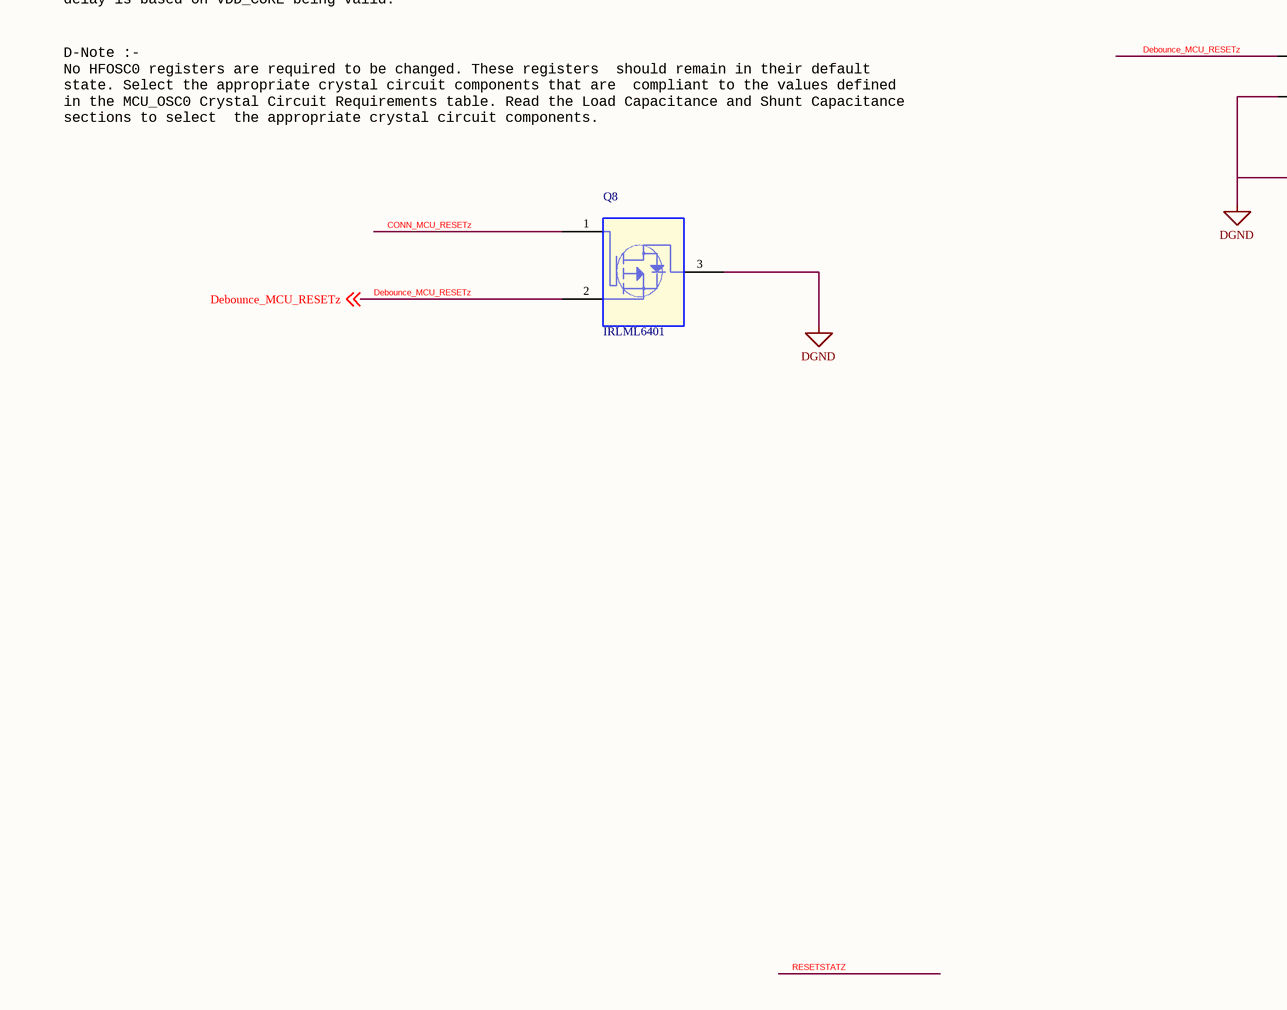
[diagram p64: 34.SchDoc, bottom left]
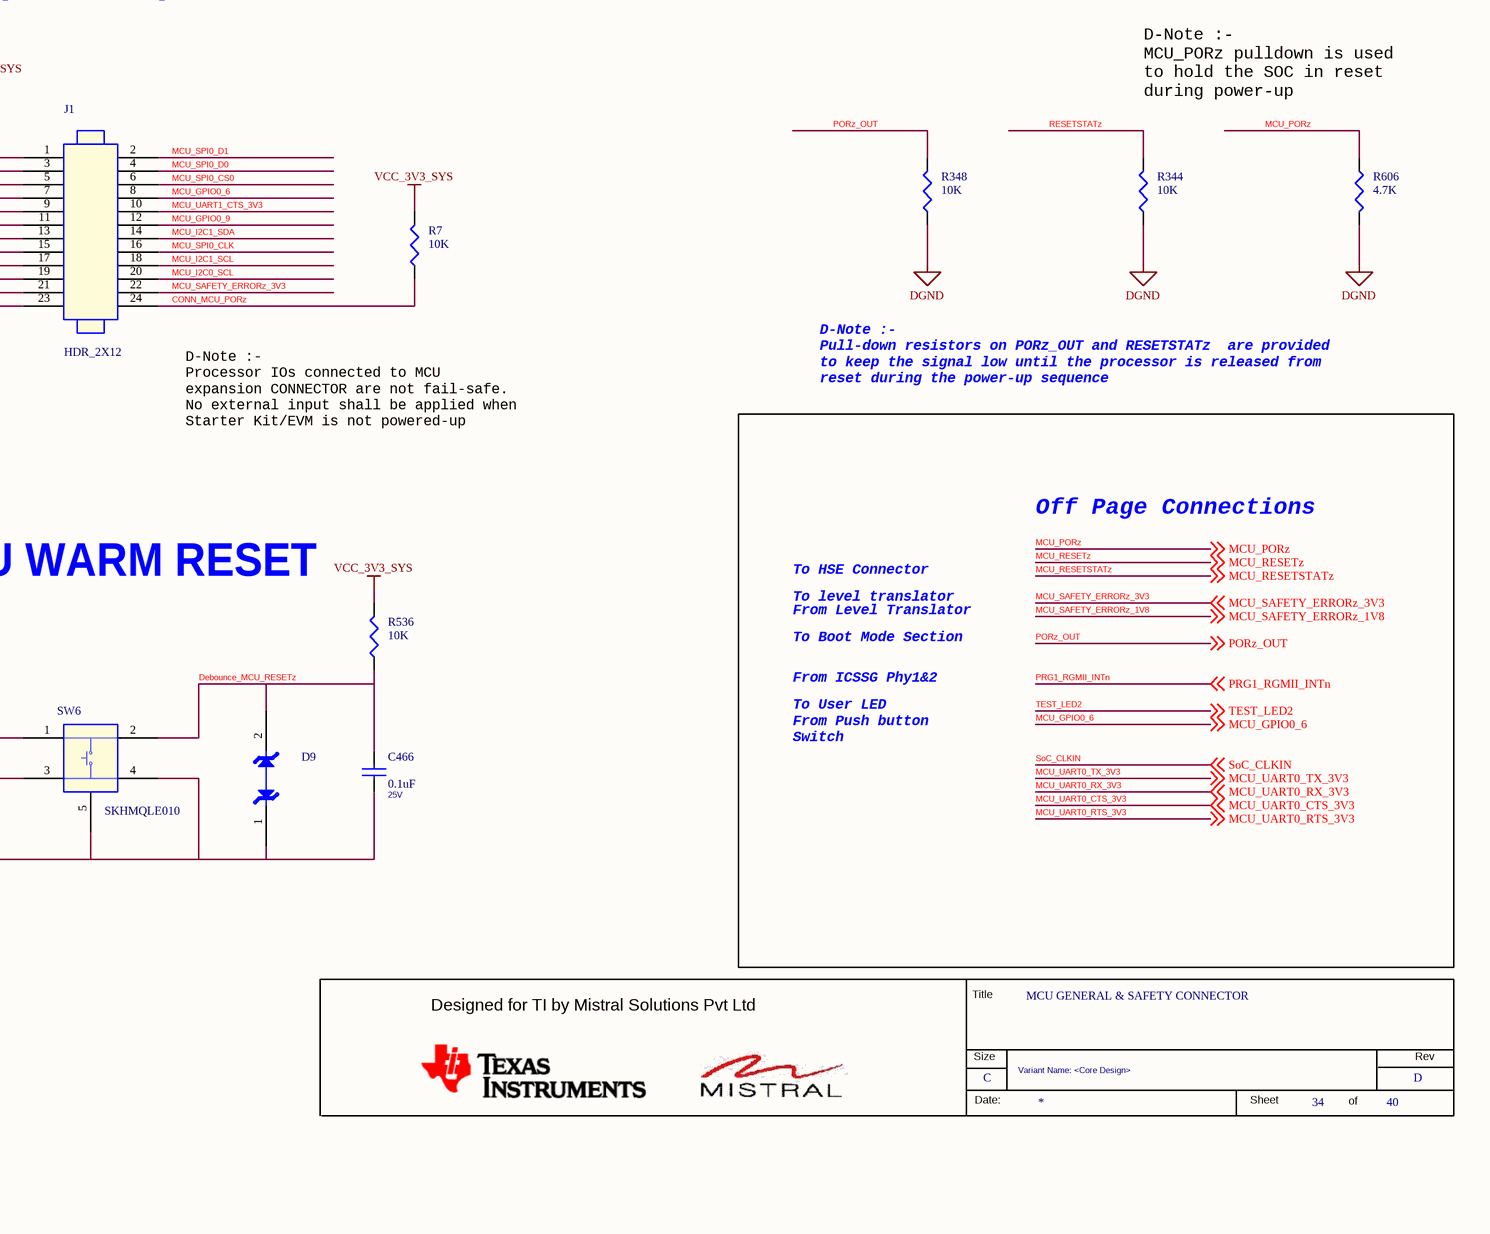
[diagram p65: 34.SchDoc, bottom right]

### Parts
(Parts that share a designator on the sheet are numbered #1, #2 ... from top to bottom, then left to right.)
*#34  RevCode: D  Title: MCU GENERAL & SAFETY CONNECTOR  Page Size: C  Page Number: 34  Page Count: 40  Variant Name: <Core Design>  (hidden comment: MISTRAL_TITLEBLK_CSIZE)  (graphical)
C5  0.1uF  Voltage: 25V  [CAP0402_0-75]
C6  1uF  Voltage: 10V  [CAP0402_0-75]
C133  12pF  Voltage: 25V  [CAP0201_0-5]
C134  12pF  Voltage: 25V  [CAP0201_0-5]
C466  0.1uF  Voltage: 25V  [CAP0402_0-75]
C485  0.1uF  Voltage: 25V  [CAP0402_0-75]
C487  10pF  Voltage: 16V  [CAP0402_0-75]
C488  10pF  Voltage: 16V  [CAP0402_0-75]
C491  10pF  Voltage: 16V  [CAP0402_0-75]
D9  TPD1E10B06DPYR  [DIO_DFN0402_0-5]  (value not drawn)
J1  HDR_2X12  [HDR_2X12_TSW-112-07-D_S_T_8-6]
Q8  IRLML6401  [TO_SOT23-123]
R6  10K  [RES0402_0-5]
R7  10K  [RES0402_0-5]
R137  0E  [RES0402_0-5]
R138  0E  [RES0402_0-5]
R139  0E  [RES0402_0-5]
R140  0E  [RES0402_0-5]
R302  22E_1%  [RES0402_0-5]
R303  4.7K  [RES0402_0-5]
R306  4.7K  [RES0402_0-5]
R309  4.7K  [RES0402_0-5]
R311  4.7K  [RES0402_0-5]
R344  10K  [RES0402_0-5]
R348  10K  [RES0402_0-5]
R536  10K  [RES0402_0-5]
R574  10K  [RES0402_0-5]
R575  10K  [RES0402_0-5]
R593  620E_1%  [RES0402_0-5]
R594  620E_1%  [RES0402_0-5]
R597  620E_1%  [RES0402_0-5]
R606  4.7K  [RES0402_0-5]
SW6  SKHMQLE010  [SW4_SKHMQLE010_240X260_SMD_3-1]
TP1  TP20_SMD  [TP20_SMD]
TP33  TP20_SMD  [TP20_SMD]  (value not drawn)
TP46  TP20_SMD  [TP20_SMD]  (value not drawn)
TP68  TP20_SMD  [TP20_SMD]  (value not drawn)
TP70  TP20_SMD  [TP20_SMD]  (value not drawn)
TP72  TP20_SMD  [TP20_SMD]
TP82  TP20_SMD  [TP20_SMD]
U23  AM6442BSFGHAALV  [FCBGA441_31-49_680X680_2-6]  (parts C,H of 16)
U35  SN74LVC1G11DCKR  [SC70-6]
Y1  25.000MHz  Mfr_part_number: ABM10W-25.0000MHZ-8-K1Z-T3  [XTAL4_ABM10W_100X80_SMD_0-6]

### Nets
DGND: C5.1 C6.2 C133.1 C134.1 C466.1 C485.1 C487.2 C488.2 C491.2 D9.1 J1.23 Q8.3(D) R140.1 R344.1 R348.1 R606.2 SW6.3 SW6.4 SW6.5(GND) U35.2(GND) Y1.2(GND1) Y1.4(GND2)
VCC1V8: C485.2 R575.1 U35.5(VCC)
VCC_3V3_SYS: C5.2 C6.1 J1.1 R6.2 R7.2 R303.1 R306.1 R309.1 R311.1 R536.2 R574.1
CONN_MCU_PORz: J1.24 R7.1 U35.3(B)
CONN_MCU_RESETz: J1.21 Q8.1(G) R6.1
Debounce_MCU_RESETz: C466.2 D9.2 Q8.2(S) R536.1 SW6.1 SW6.2 ; off-sheet Debounce_MCU_RESETz
MCU_GPIO0_6: J1.8 U23.B7(MCU_SPI1_CS1) ; off-sheet MCU_GPIO0_6
MCU_GPIO0_7: J1.9 U23.D7(MCU_SPI1_CLK)
MCU_GPIO0_8: J1.5 U23.C7(MCU_SPI1_D0)
MCU_GPIO0_9: J1.12 U23.C8(MCU_SPI1_D1)
MCU_I2C0_SCL: J1.20 R311.2 R593.1
MCU_I2C0_SCL_RC: C487.1 R593.2 U23.E9(MCU_I2C0_SCL)
MCU_I2C0_SDA: J1.17 R309.2 R594.1
MCU_I2C0_SDA_RC: C488.1 R594.2 U23.A10(MCU_I2C0_SDA)
MCU_I2C1_SCL: J1.18 R306.2 U23.A11(MCU_I2C1_SCL)
MCU_I2C1_SDA: J1.14 R303.2 U23.B10(MCU_I2C1_SDA)
MCU_OSC0_XI: R137.2 R138.2 U23.C21(MCU_OSC0_XI)
MCU_OSC0_XO: R139.2 R140.2 U23.B20(MCU_OSC0_XO)
MCU_PORz: R575.2 R606.1 TP33.1(TP) U23.B21(MCU_PORZ) U35.4(Y) ; off-sheet MCU_PORz
MCU_RESETSTATz: J1.19 TP1.1(TP) U23.B13(MCU_RESETSTATZ) ; off-sheet MCU_RESETSTATz
MCU_RESETz: TP46.1(TP) U23.B12(MCU_RESETZ) ; off-sheet MCU_RESETz
MCU_SAFETY_ERRORz_1V8: TP72.1(TP) U23.A20(MCU_SAFETY_ERRORN) ; off-sheet MCU_SAFETY_ERRORz_1V8
MCU_SAFETY_ERRORz_3V3: J1.22 ; off-sheet MCU_SAFETY_ERRORz_3V3
MCU_SPI0_CLK: J1.16 R302.1
MCU_SPI0_CLK_R: R302.2 U23.E6(MCU_SPI0_CLK)
MCU_SPI0_CS0: J1.6 U23.D6(MCU_SPI0_CS0)
MCU_SPI0_CS1: J1.3 U23.C6(MCU_SPI0_CS1)
MCU_SPI0_D0: J1.4 U23.E7(MCU_SPI0_D0)
MCU_SPI0_D1: J1.2 U23.B6(MCU_SPI0_D1)
MCU_UART0_CTS_3V3: U23.D8(MCU_UART0_CTSN) ; off-sheet MCU_UART0_CTS_3V3
MCU_UART0_RTS_3V3: U23.E8(MCU_UART0_RTSN) ; off-sheet MCU_UART0_RTS_3V3
MCU_UART0_RX_3V3: U23.A9(MCU_UART0_RXD) ; off-sheet MCU_UART0_RX_3V3
MCU_UART0_TX_3V3: U23.A8(MCU_UART0_TXD) ; off-sheet MCU_UART0_TX_3V3
MCU_UART1_CTS_3V3: J1.10 U23.B8(MCU_UART1_CTSN)
MCU_UART1_RTS_3V3: J1.13 U23.B9(MCU_UART1_RTSN)
MCU_UART1_RX_3V3: J1.11 U23.C9(MCU_UART1_RXD)
MCU_UART1_TX_3V3: J1.15 U23.D9(MCU_UART1_TXD)
PCIe_MCU_PORz: U35.6(C) ; off-sheet PCIe_MCU_PORz
PORz: R574.2 U35.1(A) ; off-sheet PORz
PORz_OUT: R348.2 TP82.1(TP) U23.E17(PORZ_OUT) ; off-sheet PORz_OUT
PRG1_RGMII_INTn: R597.1 ; off-sheet PRG1_RGMII_INTn
PRG1_RGMII_INTn_RC: C491.1 R597.2 U23.C19(EXTINTN)
RESETSTATz: R344.2 TP68.1(TP) U23.F16(RESETSTATZ) ; off-sheet RESETSTATz
SoC_CLKIN: R137.1 ; off-sheet SoC_CLKIN
SoC_WARM_RESETZ: TP70.1(TP) U23.E18(RESET_REQZ) ; off-sheet SoC_WARM_RESETZ
TEST_LED2: J1.7 U23.A7(MCU_SPI1_CS0) ; off-sheet TEST_LED2
NetC133_2: C133.2 R138.1 Y1.1
NetC134_2: C134.2 R139.1 Y1.3

### Notes on the sheet
- SOC-MCU_GENERAL
- D-Note :-
  It is recommended to connect the
  output from logic gate or discrete
  buffer (with fast rise time) as
  MCU_PORz input  rather than slow
  rising open drain output (could
  glitch internally).
- D-Note :-
  MCU_SAFETY_ERRORz_1V8
  Provision for a pulldown
  Populate when attached
  device is connected
  Refer SOC data sheet pin
  connectivity requirements
- SOC RESET
- (near R593) D-Note :-
  RC for Open drain
  output type I2C slew
  rate control
- (near R302) D-Note :-
  Add a series resistor
  22R to the SPI1 clock
  output near to the
  SoC
- 1V8
- (near R302) D-Note :-
  SOC IO buffers are off
  during reset. A pull is
  recommended near to the
  attached device that is
  being driven by the SOC IO
- R-Note :-
  Pulldown is
  enabled
- D-Note :-
  Not connecting a valid MCU_PORz  could cause
  unpredictable and probably random behavior,
  since the device is not getting a valid reset,
  internal circuits would be in random states.
  Slow  rising reset signal could  cause
  glitches internal to the SOC reset circuit.
  Use a discrete buffer and have the fast rising
  output of the buffer drive the MCU_PORz is
  recommended
- SOC - MCU (SAFETY) CONNECTOR
- D-Note :-
  MCU_PORz pulldown is used
  to hold the SOC in reset
  during power-up
- (near R137) LPF Designed for 25MHz Cutoff
  Have to change resistor and capacitor values accordingly
- CRYSTAL FOR SOC MCU_OSC0
- D-Note :-
  Connect the 25 MHz crystal
  directly to the SOC Xi and
  Xo pins (No Series or
  parallel resistors are
  recommended).
  The internal oscillator
  implements AGC (Automatic
  Gain Control) for amplitude
  control
  Match the SOC and the EPHY
  crystal specs
- D-Note :-
  Refer Applications, Implementation, and
  Layout section of the data sheet  for
  clock routing guidelines as below:
  Clock Routing Guidelines
  Oscillator Routing
- D-Note :-
  Processor IOs connected to MCU
  expansion CONNECTOR are not fail-safe.
  No external input shall be applied when
  Starter Kit/EVM is not powered-up
- D-Note :-
  Pull-down resistors on PORz_OUT and RESETSTATz  are provided
  to keep the signal low until the processor is released from
  reset during the power-up sequence
- D-Note :-
  MCU_OSC0  has been validated only with a 25 MHz clock
  source, so that is the only frequency supported.
  The datasheet shows MCU_OSC0 not starting until after
  the core voltage because there are some cases where
  the oscillator may not start until VDD_CORE is valid.
  In most cases it will start as early as VDDS_OSC0, but
  this may not always be the case.
  This diagram in the datasheet is showing the maximum
  start-up time, which must include the case where the
  delay is based on VDD_CORE being valid.
- D-Note :-
  XO should be grounded
  when an external
  oscillator is used
  Refer SOC data sheet
- Off Page Connections
- MCU WARM RESET
- To HSE Connector
- To level translator
- From Level Translator
- To Boot Mode Section
- From ICSSG Phy1&2
- D-Note :-
  No HFOSC0 registers are required to be changed. These registers  should remain in their default
  state. Select the appropriate crystal circuit components that are  compliant to the values defined
  in the MCU_OSC0 Crystal Circuit Requirements table. Read the Load Capacitance and Shunt Capacitance
  sections to select  the appropriate crystal circuit components.
- To User LED
- From Push button
  Switch
- (in symbol MISTRAL_TITLEBLK_CSIZE) Title; Designed for TI by Mistral Solutions Pvt Ltd; Size; Rev; Date:; Sheet; of

### Library data of the parts
*#34 = MISTRAL_TITLEBLK_CSIZE: Issue: 1.0; Page Create Date: March  8, 1995; Page Modify Date: *
C5 = CAP_Dup3: as C34 on sheet 31; Footprint Path: Y:\MIS_DATABASE\Library\ALTIUM_TOOL\PCB_FOOTPRINTS\Altium_Footprint_Lib.PcbLib; Library Path: Y:\MIS_DATABASE\Library\ALTIUM_TOOL\SCHEMATICS_PARTS\MS_DISCRETE_Library.schlib; Footprint Ref: CAP0402_0-75; Library Ref: CAP; MECHANICAL 3D STEP FILE: CAP0402_0-75; Chkd/date: MANIRAJA/170820; Crtd /date: ALVY/170820; Datasheet: Y:\MIS_DATABASE\DATASHEETS\CAPACITORS\885012105018.PDF; Temperature: -55癈+85癈; Weight: 0.65mg; Height: 0.55MM; Distributor_part_number: 732-7495-1-ND; Distributor_name: DIGIKEY; Package: 0402; Tolerance: 20%; PCB Footprint: CAP0402_0-75
C6 = CAP_Dup3: CAP CERAMIC 1uF 10V 20% X5R 0402; Part_type: CAPACITORS\CERAMIC; Mfr_part_number: 885012105012; Mfr_name: WURTH ELECTRONICS; Mistral Part No: 120020080009-R; Wattage: NA; Custom_Duty: 15%; Customs_HS_Code: 85322990; Project: AM64x_EVM_BRD; Footprint Ref: CAP0402_0-75; Library Ref: CAP; Footprint Path: Y:\MIS_DATABASE\Library\ALTIUM_TOOL\PCB_FOOTPRINTS\Altium_Footprint_Lib.PcbLib; Library Path: Y:\MIS_DATABASE\Library\ALTIUM_TOOL\SCHEMATICS_PARTS\MS_DISCRETE_Library.schlib; MECHANICAL 3D STEP FILE: CAP0402_0-75; Chkd/date: MANIRAJA/210820; Crtd /date: ALVY/190820; Datasheet: Y:\MIS_DATABASE\DATASHEETS\CAPACITORS\885012105012.PDF; Temperature: -55癈+85癈; Weight: 0.65mg; Height: 0.55MM; Distributor_part_number: 732-7489-1-ND; Distributor_name: DIGIKEY; Package: 0402; Tolerance: 20%; PCB Footprint: CAP0402_0-75
C133 = CAP_Dup3: CAP CERAMIC 12pF 25V 5% C0G(NP0) 0201; Part_type: CAPACITORS\CERAMIC; Mfr_part_number: GRM0335C1E120JA01D; Mfr_name: MURATA; Mistral Part No: 120009030213-R; Custom_Duty: 15%; Customs_HS_Code: 85322990; Wattage: NA; Project: QCS610_NANOSOM; PCB Footprint: CAP0201_0-5; Footprint Path: Y:\MIS_DATABASE\Library\ALTIUM_TOOL\PCB_FOOTPRINTS\Altium_Footprint_Lib.PcbLib; Library Path: Y:\MIS_DATABASE\Library\ALTIUM_TOOL\SCHEMATICS_PARTS\MS_DISCRETE_Library.schlib; MECHANICAL 3D STEP FILE: CAP0201_0-5; Chkd/date: MANIRAJA/020620; Crtd /date: ALVY/300520; Datasheet: Y:\MIS_DATABASE\DATASHEETS\CAPACITORS\GRM0335C1E120JA01.PDF; Temperature: -55癈+125癈; Weight: 0.33mg; Height: 0.33MM; Library Ref: CAP; Distributor_part_number: 490-3144-1-ND; Distributor_name: DIGIKEY; Package: 0201; Tolerance: 5%; Footprint Ref: CAP0201_0-5
C134 = CAP_Dup3: CAP CERAMIC 12pF 25V 5% C0G(NP0) 0201; Mistral Part No: 120009030213-R; Mfr_name: MURATA; Mfr_part_number: GRM0335C1E120JA01D; Part_type: CAPACITORS\CERAMIC; Project: QCS610_NANOSOM; Wattage: NA; Customs_HS_Code: 85322990; Custom_Duty: 15%; PCB Footprint: CAP0201_0-5; Footprint Ref: CAP0201_0-5; Tolerance: 5%; Package: 0201; Distributor_name: DIGIKEY; Distributor_part_number: 490-3144-1-ND; Library Ref: CAP; Height: 0.33MM; Weight: 0.33mg; Temperature: -55癈+125癈; Datasheet: Y:\MIS_DATABASE\DATASHEETS\CAPACITORS\GRM0335C1E120JA01.PDF; Crtd /date: ALVY/300520; Chkd/date: MANIRAJA/020620; MECHANICAL 3D STEP FILE: CAP0201_0-5; Library Path: Y:\MIS_DATABASE\Library\ALTIUM_TOOL\SCHEMATICS_PARTS\MS_DISCRETE_Library.schlib; Footprint Path: Y:\MIS_DATABASE\Library\ALTIUM_TOOL\PCB_FOOTPRINTS\Altium_Footprint_Lib.PcbLib
C466 C485 = CAP_Dup3: as C252 on sheet 31; Tolerance: 20%; Package: 0402; Distributor_name: DIGIKEY; Distributor_part_number: 732-7495-1-ND; Height: 0.55MM; Weight: 0.65mg; Temperature: -55癈+85癈; Datasheet: Y:\MIS_DATABASE\DATASHEETS\CAPACITORS\885012105018.PDF; Crtd /date: ALVY/170820; Chkd/date: MANIRAJA/170820; MECHANICAL 3D STEP FILE: CAP0402_0-75; Library Ref: CAP; Footprint Ref: CAP0402_0-75; Library Path: Y:\MIS_DATABASE\Library\ALTIUM_TOOL\SCHEMATICS_PARTS\MS_DISCRETE_Library.schlib; Footprint Path: Y:\MIS_DATABASE\Library\ALTIUM_TOOL\PCB_FOOTPRINTS\Altium_Footprint_Lib.PcbLib; PCB Footprint: CAP0402_0-75
C487 C488 C491 = CAP_Dup3: as C247 on sheet 31; Footprint Ref: CAP0402_0-75; Tolerance: 5%; Package: 0402; Distributor_name: DIGIKEY; Distributor_part_number: 732-7441-1-ND; Library Ref: CAP; Height: 0.55MM; Weight: 0.65mg; Temperature: -55癈+125癈; Datasheet: Y:\MIS_DATABASE\DATASHEETS\CAPACITORS\885012005025.PDF; Crtd /date: ALVY/100918; Chkd/date: MANIRAJA/100918; MECHANICAL 3D STEP FILE: CAP0402_0-75; Library Path: Y:\MIS_DATABASE\Library\ALTIUM_TOOL\SCHEMATICS_PARTS\MS_DISCRETE_Library.schlib; Footprint Path: Y:\MIS_DATABASE\Library\ALTIUM_TOOL\PCB_FOOTPRINTS\Altium_Footprint_Lib.PcbLib; PCB Footprint: CAP0402_0-75
D9 = DIODE_SOD323: DIODE 1CH ESD PROTECTION X1SON2; Mistral Part No: 130014110022-R; Mfr_name: TEXAS INSTRUMENTS; Project: GALILEO_EVM; Tolerance: NA; Customs_HS_Code: 85423100; Custom_Duty: 15%; Footprint Ref: DIO_DFN0402_0-5; Mfr_part_number: TPD1E10B06DPYR; Part_type: DIODE; Voltage: NA; Wattage: NA; Package: X1SON2; Distributor_name: DIGIKEY; Distributor_part_number: 296-30406-1-ND; Library Ref: DIODE_SOD323; Height: 0.45MM; Weight: 1mg; Temperature: -40癈+125癈; Datasheet: Y:\MIS_DATABASE\DATASHEETS\ICS\INTERFACE\TPD1E10B06-SER.PDF; Crtd /date: VASANTHA/181114; Chkd/date: MANIRAJA/040420; MECHANICAL 3D STEP FILE: DIO_DFN0402_0-5; Library Path: Y:\MIS_DATABASE\Library\ALTIUM_TOOL\SCHEMATICS_PARTS\MS_DISCRETE_Library.schlib; Footprint Path: Y:\MIS_DATABASE\Library\ALTIUM_TOOL\PCB_FOOTPRINTS\Altium_Footprint_Lib.PcbLib; PCB Footprint: DIO_DFN0402_0-5
J1 = HEADER_12X2: CON HDR 2X12 2.54MM PITCH ST TH; Mistral Part No: 150020040027-R; Mfr_name: SAMTEC; Mfr_part_number: TSW-112-07-S-D; Part_type: CONNECTOR\HEADERS; Project: AM64x-GP_EVM BRD; Tolerance: NA; Customs_HS_Code: 85369090; Custom_Duty: 24%; PCB Footprint: HDR_2X12_TSW-112-07-D_S_T_8-6; Footprint Ref: HDR_2X12_TSW-112-07-D_S_T_8-6; Voltage: NA; Wattage: NA; Package: THRU-HOLE; Distributor_name: DIGIKEY; Distributor_part_number: SAM1032-12-ND; Library Ref: HEADER_12X2; Height: 8.58MM; Weight: NA; Temperature: -55癈+125癈; Datasheet: Y:\MIS_DATABASE\DATASHEETS\CONNECTORS\SAM_TSW-SER.PDF; Crtd /date: ALVY/240420; Chkd/date: MANIRAJA/250420; MECHANICAL 3D STEP FILE: HDR_2X12_TSW-112-07-D_S_T_8-6; Library Path: Y:\MIS_DATABASE\Library\ALTIUM_TOOL\SCHEMATICS_PARTS\MS_CONNECTOR_Library.schlib; Footprint Path: Y:\MIS_DATABASE\Library\ALTIUM_TOOL\PCB_FOOTPRINTS\Altium_Footprint_Lib.PcbLib
Q8 = MOSFET_IRLML6401TR: TRANSISTOR MOSFET P-CHANNEL SOT23-3; Part_type: TRANSISTOR\MOSFET; Mfr_part_number: IRLML6401TRPBF; Mfr_name: IRF; Mistral Part No: 130009031213-P; Custom_Duty: 15%; Customs_HS_Code: 85412900; Wattage: NA; Project: G4_SVGA; PCB Footprint: TO_SOT23-123; Library Ref: MOSFET_IRLML6401TR; RoHS: Pb-Free; Chkd/date: SHREESHAIL/020206; Crtd /date: MAZHAR/040505; Datasheet: Y:\MIS_DATABASE\DATASHEETS\DISCRETES\TRANSISTORS_FETS\IRLML6401.PDF; Temperature: -55癈+150癈; Weight: NA; Height: 1.11MM; Distributor_part_number: IRLML6401PBFCT-ND; Distributor_name: DIGIKEY; Package: SOT23-3; Voltage: NA; Tolerance: NA
R6 R7 R344 R574 R575 = RESISTOR_Dup6: as R248 on sheet 31; Tolerance: 5%; Wattage: 1/16W; Package: 0402; Distributor_name: DIGIKEY; Distributor_part_number: 311-10KJRCT-ND; Height: 0.40MM; Weight: 0.65mg; Temperature: -55癈+155癈; Datasheet: Y:\MIS_DATABASE\DATASHEETS\RESISTORS\RCXXXXL-SER_MAR18.PDF; Crtd /date: MAZHAR/230805; Chkd/date: VASANTHA/061216; MECHANICAL 3D STEP FILE: RES0402_0-5; Library Ref: RESISTOR; Footprint Ref: RES0402_0-5; Library Path: Y:\MIS_DATABASE\Library\ALTIUM_TOOL\SCHEMATICS_PARTS\MS_DISCRETE_Library.schlib; Footprint Path: Y:\MIS_DATABASE\Library\ALTIUM_TOOL\PCB_FOOTPRINTS\Altium_Footprint_Lib.PcbLib; PCB Footprint: RES0402_0-5
R137-R140 = RESISTOR_Dup5: as R246 on sheet 31; PCB Footprint: RES0402_0-5; MECHANICAL 3D STEP FILE: RES0402_0-5; Chkd/date: VASANTHA/201216; Crtd /date: MUDDU/190810; Datasheet: Y:\MIS_DATABASE\DATASHEETS\RESISTORS\CRCW0603.PDF; Temperature: -55癈+155癈; Weight: 0.65mg; Height: 0.40MM; Distributor_part_number: 541-0.0JCT-ND; Distributor_name: DIGIKEY; Package: 0402; Wattage: 1/16W; Tolerance: NA; Library Ref: RESISTOR; Footprint Ref: RES0402_0-5; Library Path: Y:\MIS_DATABASE\Library\ALTIUM_TOOL\SCHEMATICS_PARTS\MS_DISCRETE_Library.schlib; Footprint Path: Y:\MIS_DATABASE\Library\ALTIUM_TOOL\PCB_FOOTPRINTS\Altium_Footprint_Lib.PcbLib
R302 = RESISTOR_Dup5: as R235 on sheet 31; Library Ref: RESISTOR; Tolerance: 1%; Wattage: 1/16W; Package: 0402; Distributor_name: DIGIKEY; Distributor_part_number: 311-22.0LRCT-ND; Height: 0.40MM; Weight: 0.65mg; Temperature: -55癈+155癈; Datasheet: Y:\MIS_DATABASE\DATASHEETS\RESISTORS\RCXXXXL-SER_MAR18.PDF; Crtd /date: MAZHAR/090909; Chkd/date: SUHAS/290910; Footprint Ref: RES0402_0-5; MECHANICAL 3D STEP FILE: RES0402_0-5; Library Path: Y:\MIS_DATABASE\Library\ALTIUM_TOOL\SCHEMATICS_PARTS\MS_DISCRETE_Library.schlib; Footprint Path: Y:\MIS_DATABASE\Library\ALTIUM_TOOL\PCB_FOOTPRINTS\Altium_Footprint_Lib.PcbLib; PCB Footprint: RES0402_0-5
R303 R306 R606 = RESISTOR_Dup6: RES 4.7K 1/16W 5% 0402; Mistral Part No: 110011060001-R; Mfr_name: YAGEO AMERICA; Mfr_part_number: RC0402JR-074K7L; Part_type: RESISTORS\FIXED; Project: TMDXCSK368; Voltage: NA; Customs_HS_Code: 85332119; Custom_Duty: 15%; Footprint Path: Y:\MIS_DATABASE\Library\ALTIUM_TOOL\PCB_FOOTPRINTS\Altium_Footprint_Lib.PcbLib; Library Path: Y:\MIS_DATABASE\Library\ALTIUM_TOOL\SCHEMATICS_PARTS\MS_DISCRETE_Library.schlib; MECHANICAL 3D STEP FILE: RES0402_0-5; Footprint Ref: RES0402_0-5; Library Ref: RESISTOR; Tolerance: 5%; Wattage: 1/16W; Package: 0402; Distributor_name: DIGIKEY; Distributor_part_number: 311-4.7KJRCT-ND; Height: 0.40MM; Weight: 0.65mg; Temperature: -55癈+155癈; Datasheet: Y:\MIS_DATABASE\DATASHEETS\RESISTORS\RCXXXXL-SER_MAR18.PDF; Crtd /date: VASANTHA/130516; Chkd/date: VASANTHA/130516; PCB Footprint: RES0402_0-5
R309 R311 = RESISTOR_Dup6: RES 4.7K 1/16W 5% 0402; Part_type: RESISTORS\FIXED; Mfr_part_number: RC0402JR-074K7L; Mfr_name: YAGEO AMERICA; Mistral Part No: 110011060001-R; Custom_Duty: 15%; Customs_HS_Code: 85332119; Voltage: NA; Project: TMDXCSK368; Chkd/date: VASANTHA/130516; Crtd /date: VASANTHA/130516; Datasheet: Y:\MIS_DATABASE\DATASHEETS\RESISTORS\RCXXXXL-SER_MAR18.PDF; Temperature: -55癈+155癈; Weight: 0.65mg; Height: 0.40MM; Distributor_part_number: 311-4.7KJRCT-ND; Distributor_name: DIGIKEY; Package: 0402; Wattage: 1/16W; Tolerance: 5%; Library Ref: RESISTOR; Footprint Ref: RES0402_0-5; MECHANICAL 3D STEP FILE: RES0402_0-5; Library Path: Y:\MIS_DATABASE\Library\ALTIUM_TOOL\SCHEMATICS_PARTS\MS_DISCRETE_Library.schlib; Footprint Path: Y:\MIS_DATABASE\Library\ALTIUM_TOOL\PCB_FOOTPRINTS\Altium_Footprint_Lib.PcbLib; PCB Footprint: RES0402_0-5
R348 R536 = RESISTOR_Dup6: as R40 on sheet 31; PCB Footprint: RES0402_0-5; MECHANICAL 3D STEP FILE: RES0402_0-5; Chkd/date: VASANTHA/061216; Crtd /date: MAZHAR/230805; Datasheet: Y:\MIS_DATABASE\DATASHEETS\RESISTORS\RCXXXXL-SER_MAR18.PDF; Temperature: -55癈+155癈; Weight: 0.65mg; Height: 0.40MM; Distributor_part_number: 311-10KJRCT-ND; Distributor_name: DIGIKEY; Package: 0402; Wattage: 1/16W; Tolerance: 5%; Library Ref: RESISTOR; Footprint Ref: RES0402_0-5; Library Path: Y:\MIS_DATABASE\Library\ALTIUM_TOOL\SCHEMATICS_PARTS\MS_DISCRETE_Library.schlib; Footprint Path: Y:\MIS_DATABASE\Library\ALTIUM_TOOL\PCB_FOOTPRINTS\Altium_Footprint_Lib.PcbLib
R593 R594 R597 = RESISTOR_Dup1: RES 620E 1/10W 1% 0402; Mistral Part No: 110012090013-R; Mfr_name: PANASONIC-ECG; Mfr_part_number: ERJ-2RKF6200X; Part_type: RESISTORS\FIXED; Project: ITS-CONTROLER_CARD; Voltage: NA; Customs_HS_Code: 85332119; Custom_Duty: 15%; Footprint Ref: RES0402_0-5; Tolerance: 1%; Wattage: 1/10W; Package: 0402; Distributor_name: DIGIKEY; Distributor_part_number: P620LCT-ND; Library Ref: RESISTOR; Height: 0.40MM; Weight: 0.8mg; Temperature: -55癈+155癈; Datasheet: Y:\MIS_DATABASE\DATASHEETS\RESISTORS\PAN-ERJSER_NOV17.PDF; Crtd /date: CHAITHANYA/270912; Chkd/date: USMAN/120313; MECHANICAL 3D STEP FILE: RES0402_0-5; Library Path: Y:\MIS_DATABASE\Library\ALTIUM_TOOL\SCHEMATICS_PARTS\MS_DISCRETE_Library.schlib; Footprint Path: Y:\MIS_DATABASE\Library\ALTIUM_TOOL\PCB_FOOTPRINTS\Altium_Footprint_Lib.PcbLib; PCB Footprint: RES0402_0-5
SW6 = SW4_SKHUPLE010: SWITCH TACTILE SPST ST SMD; Mistral Part No: 130017100007-R; Mfr_name: ALPS; Part_type: ELECTRO-MECHANICAL\SWITCH; Project: TI_MAXIE_CPB; Tolerance: NA; Customs_HS_Code: 85369090; Custom_Duty: 24%; Mfr_part_number: SKHMQLE010; Voltage: NA; Wattage: NA; Package: SMD; Distributor_name: MOUSER; Distributor_part_number: 688-SKHMQLE010; Height: 3.10MM; Weight: NA; Temperature: -30癈+85癈; Datasheet: Y:\MIS_DATABASE\DATASHEETS\MISC\SWITCHES\SKHMQLE010.PDF; Crtd /date: MANIRAJA/051017; Chkd/date: MANIRAJA/051017; MECHANICAL 3D STEP FILE: SW4_SKHMQLE010_240X260_SMD_3-1; Library Ref: SW4_SKHUPLE010; PCB Footprint: SW4_SKHMQLE010_240X260_SMD_3-1
TP1 TP82 = TESTPOINT: as TP101 on sheet 33; PCB Footprint: TP20_SMD; Mfr_part_number: TP20_SMD; Part_type: TESTPOINT; Package: SMD; Distributor_name: NA; Distributor_part_number: NA; Height: NA; Crtd /date: MAZHAR/171006; Chkd/date: SHREESHAIL/171006; Tolerance: NA; Voltage: NA; Wattage: NA; Weight: NA; Temperature: NA; Datasheet: NA; MECHANICAL 3D STEP FILE: NA; Library Path: Y:\MIS_DATABASE\Library\ALTIUM_TOOL\SCHEMATICS_PARTS\MS_DISCRETE_Library.schlib; Footprint Path: Y:\MIS_DATABASE\Library\ALTIUM_TOOL\PCB_FOOTPRINTS\Altium_Footprint_Lib.PcbLib; Library Ref: TESTPOINT; Footprint Ref: TP20_SMD; RoHS: NA; Customs_HS_Code: NA; Custom_Duty: NA
TP33 TP46 TP68 TP70 = TESTPOINT: as TP86-TP91 on sheet 33; PCB Footprint: TP20_SMD; Customs_HS_Code: NA; Footprint Path: Y:\MIS_DATABASE\Library\ALTIUM_TOOL\PCB_FOOTPRINTS\Altium_Footprint_Lib.PcbLib; Library Path: Y:\MIS_DATABASE\Library\ALTIUM_TOOL\SCHEMATICS_PARTS\MS_DISCRETE_Library.schlib; MECHANICAL 3D STEP FILE: NA; Datasheet: NA; Temperature: NA; Weight: NA; Wattage: NA; Voltage: NA; Tolerance: NA; Chkd/date: SHREESHAIL/171006; Crtd /date: MAZHAR/171006; Height: NA; Distributor_part_number: NA; Distributor_name: NA; Package: SMD; Part_type: TESTPOINT; Mfr_part_number: TP20_SMD; Mistral Part No: NA; Library Ref: TESTPOINT; Footprint Ref: TP20_SMD; RoHS: NA
TP72 = TESTPOINT: TESTPOINT CIR 20 SMD; Mfr_name: LOCAL; MECHANICAL 3D STEP FILE: NA; Project: BT MODULE_CSRBC04; PCB Footprint: TP20_SMD; RoHS: NA; Footprint Ref: TP20_SMD; Library Ref: TESTPOINT; Footprint Path: Y:\MIS_DATABASE\Library\ALTIUM_TOOL\PCB_FOOTPRINTS\Altium_Footprint_Lib.PcbLib; Library Path: Y:\MIS_DATABASE\Library\ALTIUM_TOOL\SCHEMATICS_PARTS\MS_DISCRETE_Library.schlib; Datasheet: NA; Temperature: NA; Weight: NA; Wattage: NA; Voltage: NA; Tolerance: NA; Chkd/date: SHREESHAIL/171006; Crtd /date: MAZHAR/171006; Height: NA; Distributor_part_number: NA; Distributor_name: NA; Package: SMD; Part_type: TESTPOINT; Mfr_part_number: TP20_SMD; Mistral Part No: NA; Customs_HS_Code: NA; Custom_Duty: NA
U23 = XAM6442BSFGGAALV_BGA441: as U23 on sheet 32; PCB Footprint: FCBGA441_31-49_680X680_2-6; Footprint Ref: FCBGA441_31-49_680X680_2-6; Mfr_part_number: AM6442BSFGHAALV; Voltage: NA; Wattage: NA; Package: BGA441; Distributor_name: NA; Distributor_part_number: NA; Library Ref: XAM6442BSFGGAALV_BGA441; Height: 2.57MM; Weight: NA; Temperature: NA; Datasheet: Y:\MIS_DATABASE\DATASHEETS\ICS\DIGITAL\MICROCONTROLLER\AM64-SoC_SVB.PDF; Crtd /date: ALVY/300322; Chkd/date: ALVY/300322; RoHS: NA; MECHANICAL 3D STEP FILE: FCBGA441_31-49_680X680_2-6; Library Path: Y:\MIS_DATABASE\Library\ALTIUM_TOOL\SCHEMATICS_PARTS\MS_MICROPROCESSOR_Library.schlib; Footprint Path: Y:\MIS_DATABASE\Library\ALTIUM_TOOL\PCB_FOOTPRINTS\Altium_Footprint_Lib.PcbLib
U35 = SN74LVC1G11DCKR_SC70-6: IC SINGLE 3-INPUT POSITIVE-AND GATE SC70-6; Mistral Part No: 141009030230-R; Mfr_name: TEXAS INSTRUMENTS; Part_type: ICS\DIGITAL\GATES; Project: VOCERA; Customs_HS_Code: 85423100; Custom_Duty: 15%; PCB Footprint: SC70-6; Library Ref: SN74LVC1G11DCKR_SC70-6; Mfr_part_number: SN74LVC1G11DCKR; Package: SC70-6; Distributor_name: DIGIKEY; Distributor_part_number: 296-18066-1-ND; Height: 1.10MM; Datasheet: Y:\MIS_DATABASE\DATASHEETS\ICS\DIGITAL\GATES\SN74LVC1G.PDF; Crtd /date: MAZHAR/150506; Chkd/date: SHREESHAIL/220506; RoHS: Sb/ Br FREE
Y1 = CRY4_ABM8G: CRY 25.000MHz 8pF SMD; Mistral Part No: 130020060044-R; Mfr_name: ABRACON CORPORATION; Part_type: CRYSTAL; Project: AM64x_SVB DUT BRD; Tolerance: NA; Customs_HS_Code: 85439000; Custom_Duty: 24%; PCB Footprint: XTAL4_ABM10W_100X80_SMD_0-6; Footprint Ref: XTAL4_ABM10W_100X80_SMD_0-6; Voltage: NA; Wattage: NA; Package: SMD; Distributor_name: DIGIKEY; Distributor_part_number: 535-13736-1-ND; Library Ref: CRY4_ABM8G; Height: 0.60MM; Weight: NA; Temperature: -40癈+125癈; Datasheet: Y:\MIS_DATABASE\DATASHEETS\MISC\CRY_OSC\ABM10W.PDF; Crtd /date: ALVY/250620; Chkd/date: MANIRAJA/250620; MECHANICAL 3D STEP FILE: XTAL4_ABM10W_100X80_SMD_0-6; Library Path: Y:\MIS_DATABASE\Library\ALTIUM_TOOL\SCHEMATICS_PARTS\MS_DISCRETE_Library.schlib; Footprint Path: Y:\MIS_DATABASE\Library\ALTIUM_TOOL\PCB_FOOTPRINTS\Altium_Footprint_Lib.PcbLib